# EAGLE board wio terminal (EAGLE 9.5.2), part 1 of 2
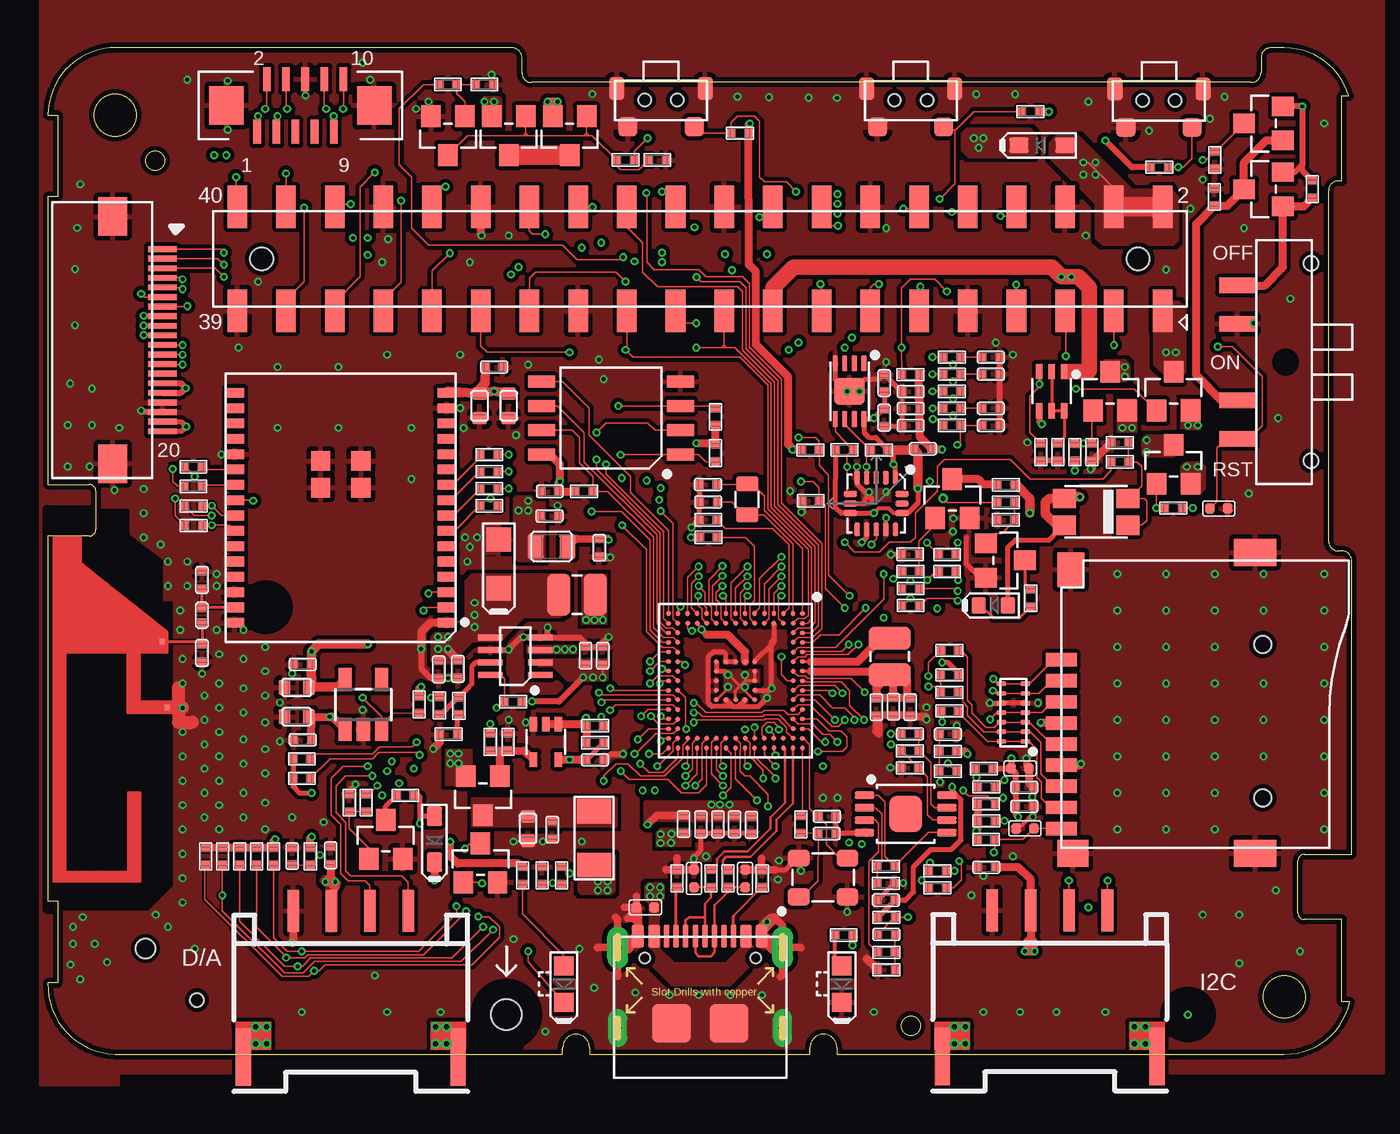
[diagram p8: board, top side]
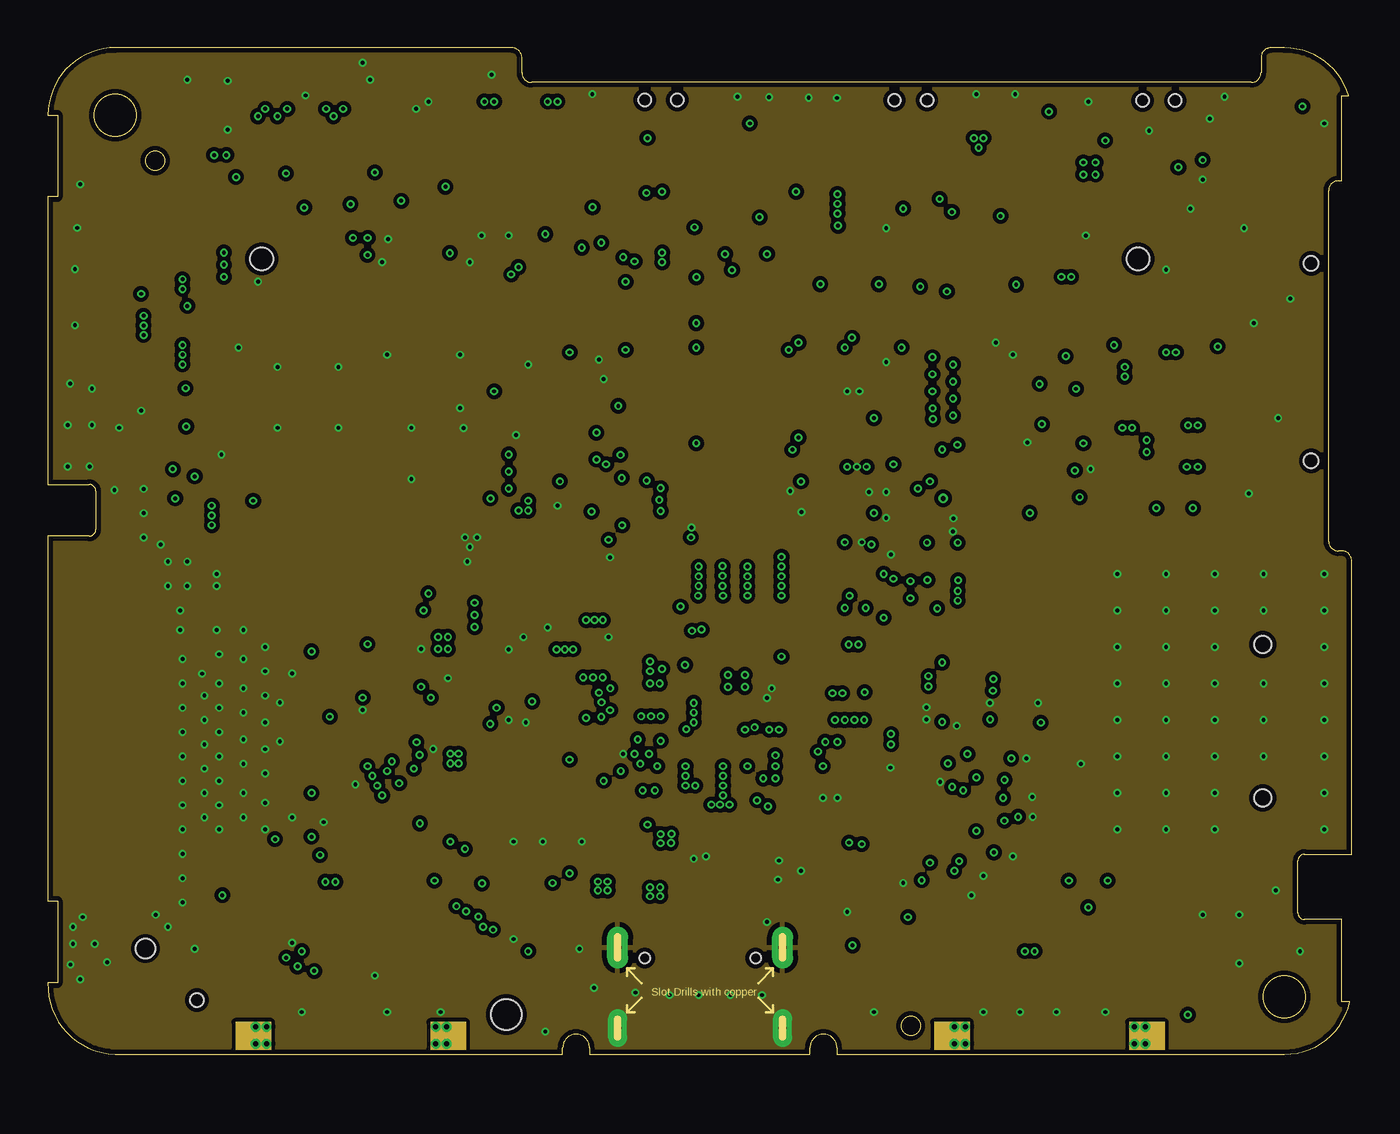
[diagram p9: board, inner layer Route2]
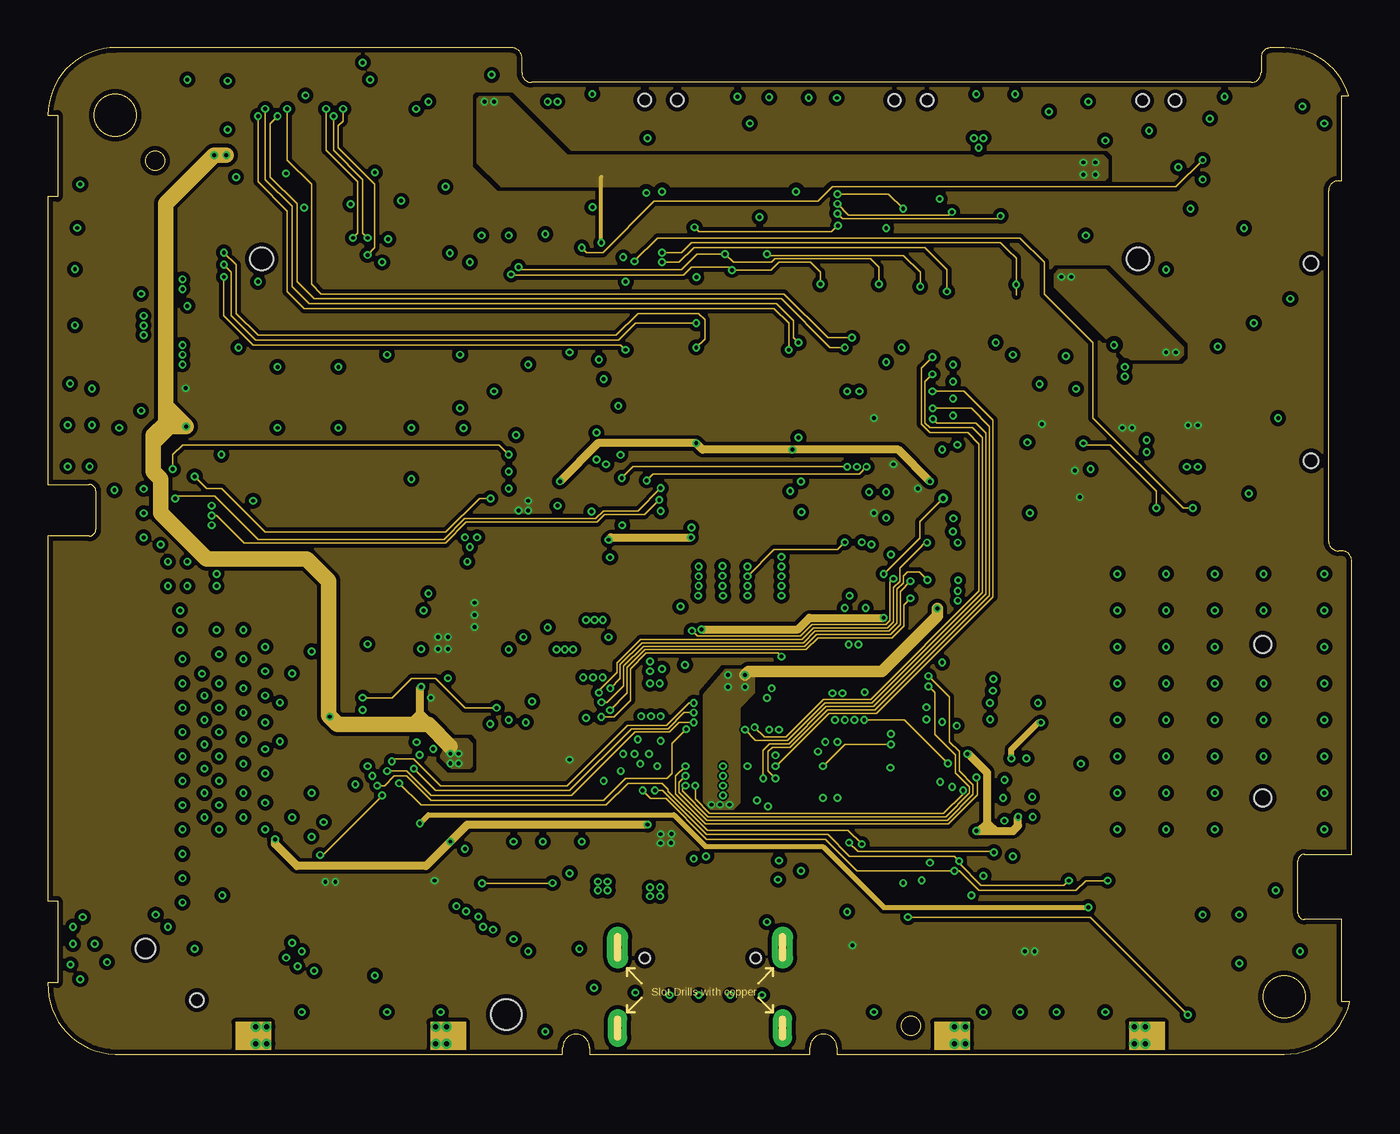
[diagram p10: board, inner layer Route15]
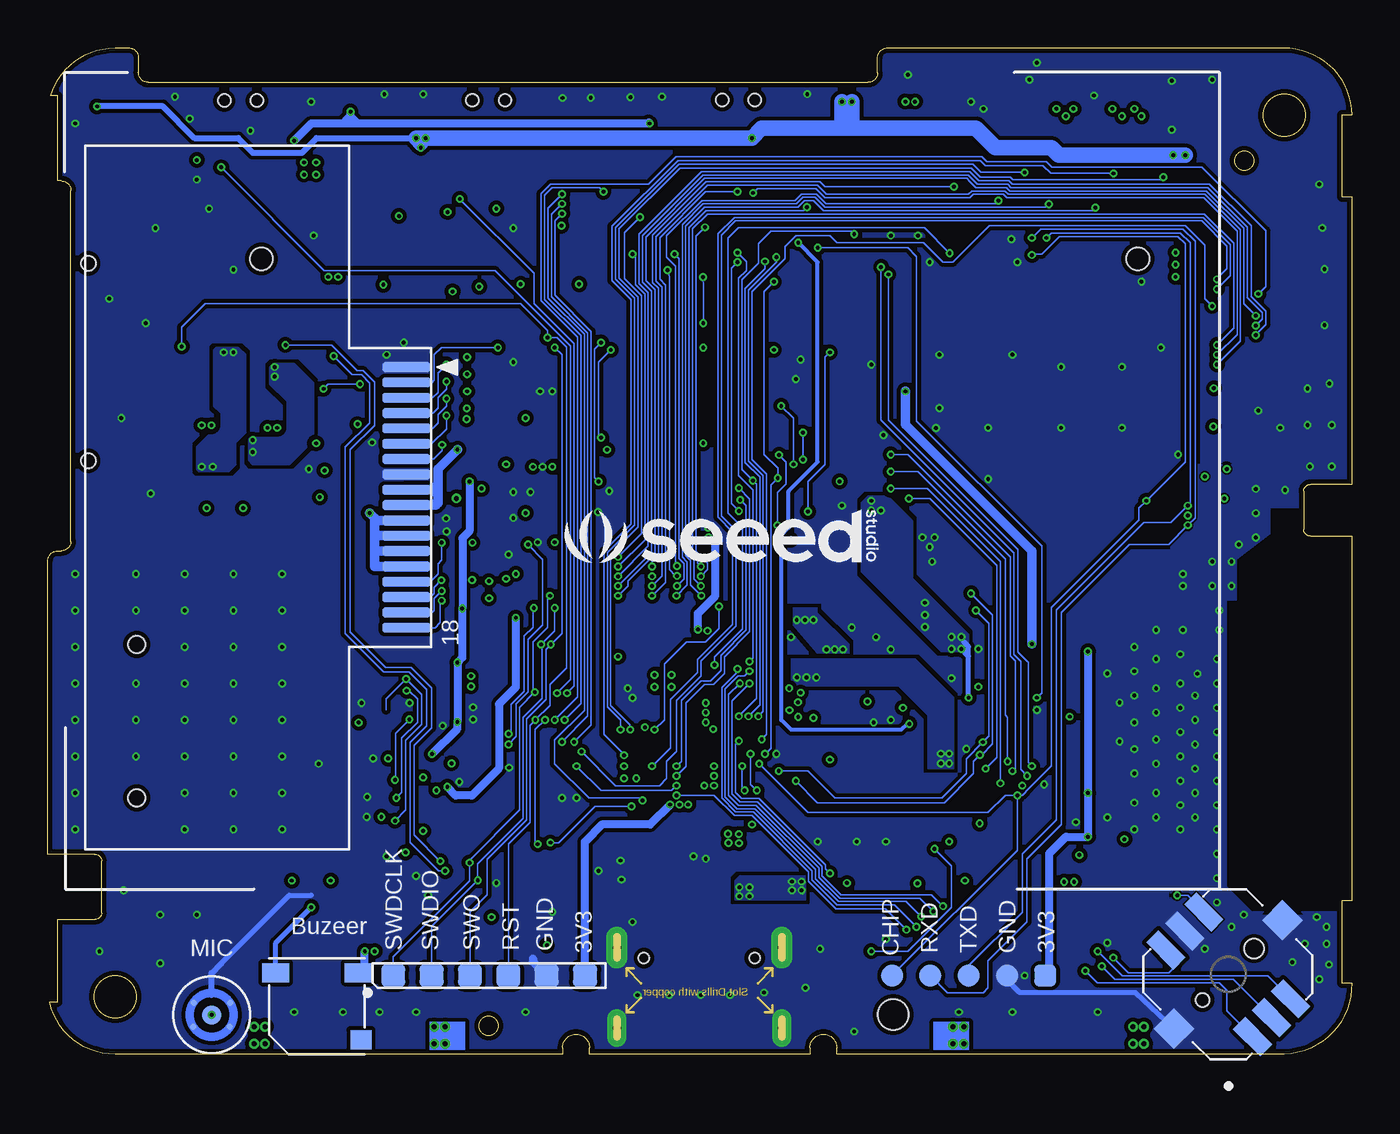
[diagram p11: board, bottom side, seen from below]

Size 68 x 52.5 mm. Coordinates in mm from the lower left corner, seen from the top.
Outline: 131 segments
Outline: circle at 64.5,3 radius 1.1
Outline: circle at 3.5,49 radius 1.1
Outline: circle at 5.6,46.62 radius 0.5
Outline: circle at 45,1.49 radius 0.5
Copper layers (1*2*15*16): Top 0.035mm / dielectric 0.2mm / Route2 0.0175mm / dielectric 0.3mm / Route15 0.0175mm / dielectric 0.2mm / Bottom 0.035mm
Design rules "SeeedStudio_4layer_DRU_no_angle_20140221 *": minimum track width 1mil, minimum drill 8mil, track to track 3.5mil, track to pad 3.5mil, pad to pad 3.5mil, via to via 3.5mil, smd to smd 0mil, copper to edge 10mil, drill to drill 8mil, minimum pad ring 4mil, minimum via ring 4mil, stop-mask expansion 4mil, vias tented up to drill 25mil, thermal gap 10mil
Holes 1.6 mm at 23.91,2.08
tRestrict: area 0,17.3 to 0.4,18.1; area 58.3,0.9 to 60.6,3.2; area 64.1,35.7 to 65,36.6; area 22.3,0.4 to 25.6,3.7

## Footprints (pad centres in the part's own frame; a part is rotated, then mirrored left to right if it is on the bottom)
ANT2P-AMEBA-D-MODULE = smd 0.26 x 0.26: 1 9.41,0.294; 2 12.86,0.544
BZ3-SMD-5.0X5.0X2.5MM = smd 1.4 x 1: + -2.15,-1.75; - 2.15,-1.75 | smd 1.1 x 1: NC -2.3,1.75
C0603 = smd 0.635 x 0.762: 1 -0.635,0; 2 0.635,0
C0402 = smd 0.445 x 0.508: 1 -0.445,0; 2 0.445,0
AVX-A = smd 1.27 x 1.27: + 1.27,0; - -1.27,0
ESD-0402 = smd 0.5 x 0.5: 1 -0.463,0; 2 0.463,0
SOD-323 = smd 1 x 0.8: + 1.2,0; - -1.2,0
LED-SIDE-VIEW-0603-RIGHT = smd 1 x 1: 1 0.95,0; 2 -0.95,0
LED-0603 = smd 0.762 x 0.889: + 0.762,0; - -0.762,0
UDFN14-0.5-3.5X1.35X0.5MM = smd 0.25 x 0.5: 1 -1.5,-0.625; 2 -1,-0.625; 3 -0.5,-0.625; 4 0,-0.625; 5 0.5,-0.625; 6 1,-0.625; 7 1.5,-0.625; 8 1.5,0.625; 9 1,0.625; 10 0.5,0.625; 11 0,0.625; 12 -0.5,0.625; 13 -1,0.625; 14 -1.5,0.625
F1206 = smd 1.27 x 1.778: 1 -1.397,0; 2 1.397,0
F0402 = smd 0.445 x 0.508: 1 -0.445,0; 2 0.445,0
MICRO-SD9+4P-SMD-16.1X14.5X1.85MM = smd 1.6 x 0.7: 1 0,2.25; 2 0,1.15; 3 0,0.05; 4 0,-1.05; 5 0,-2.15; 6 0,-3.25; 7 0,-4.35; 8 0,-5.45; 9 0,-6.55 | smd 1.6 x 1.4: G1 0.6,-7.85 | smd 2.2 x 1.4: G2 10.1,-7.85; G3 10.1,7.85 | smd 1.4 x 1.8: G4 0.5,6.95 | hole 0.9: 10.5,-4.95; 10.5,3.05
H5-SMD-2.0-TEST = smd 1.143 x 1.143: 1 0,4; 2 0,2; 3 0,0; 4 0,-2; 5 0,-4
FPC10-SMD-0.5-10.6X3.5X4.5MM = smd 0.4 x 1.25: 1 -2.25,-1.375; 2 -1.75,1.375; 3 -1.25,-1.375; 4 -0.75,1.375; 5 -0.25,-1.375; 6 0.25,1.375; 7 0.75,-1.375; 8 1.25,1.375; 9 1.75,-1.375; 10 2.25,1.375 | smd 1.8 x 2: P1 -3.85,0; P2 3.85,0
HW4-SMD-2.0-90D = smd 0.6 x 2.2: 1 -3,-0.225; 2 -1,-0.225; 3 1,-0.225; 4 3,-0.225 | smd 0.8 x 3: SS1 -5.6,7.4; SS2 5.6,7.4
FPC20-SMD-0.5-90D = smd 0.3 x 1.5: 1 -4.75,3.15; 2 -4.25,3.15; 3 -3.75,3.15; 4 -3.25,3.15; 5 -2.75,3.15; 6 -2.25,3.15; 7 -1.75,3.15; 8 -1.25,3.15; 9 -0.75,3.15; 10 -0.25,3.15; 11 0.25,3.15; 12 0.75,3.15; 13 1.25,3.15; 14 1.75,3.15; 15 2.25,3.15; 16 2.75,3.15; 17 3.25,3.15; 18 3.75,3.15; 19 4.25,3.15; 20 4.75,3.15 | smd 2 x 1.5: P1 -6.45,0.55; P2 6.45,0.55
H6-SMD-2.0_TEST = smd 1.27 x 1.27: 1 0,5; 2 0,3; 3 0,1; 4 0,-1; 5 0,-3; 6 0,-5
SW2+2P-3.45-4.8X2.5X1.8MM = smd 1 x 1: 1 -1.725,-1.4; 2 1.725,-1.4 | smd 0.8 x 1.2: 3 -2.3,0.6; 4 2.3,0.6 | hole 0.65: -0.85,0; 0.85,0
L0805 = smd 0.826 x 1.27: 1 -0.826,0; 2 0.826,0
L0402 = smd 0.508 x 0.508: 1 -0.406,0; 2 0.406,0
L2520 = smd 1.2 x 2.2: 1 -0.95,0; 2 0.95,0
MIC2-SMD-4X4MM = smd 1 x 1: 1 0,0 | smd 0.35 x 0.35: 2 -0.934,0.635; 3 0.953,0.617; 4 0.934,-0.635; 5 -0.953,-0.617
SOT-23 = smd 1.143 x 1.016: 1 1.016,-0.889; 2 1.016,0.889; 3 -1.016,0
SOT-363 = smd 0.35 x 0.8: 1 -0.65,-1.025; 2 0,-1.025; 3 0.65,-1.025; 4 0.65,1.025; 5 0,1.025; 6 -0.65,1.025
R0402 = smd 0.445 x 0.508: 1 -0.445,0; 2 0.445,0
SWITCH-2X3P = smd 0.9 x 2: 1 -1.4,-3.2; 2 0,-3.2; 3 1.4,-3.2; 4 -1.4,3.2; 5 0,3.2; 6 1.4,3.2 | smd 1.5 x 1.5: 7 4,0; 8 -4,0 | hole 0.7: -1.9,0 | hole 1: 1.9,0
SW4-SMD-11.2X3.6MM = smd 0.8 x 1.9: 1 -4,-0.35; 2 -2,-0.35; 3 2,-0.35; 4 4,-0.35 | hole 0.75: -5.15,-4.2; 5.15,-4.2
TFBGA120-0.5-8X8MM = smd 0.229 x 0.279: A1 -3.5,3.5; A2 -3,3.5; A3 -2.5,3.5; A4 -2,3.5; A5 -1.5,3.5; A6 -1,3.5; A7 -0.5,3.5; A8 0,3.5; A9 0.5,3.5; A10 1,3.5; A11 1.5,3.5; A12 2,3.5; A13 2.5,3.5; A14 3,3.5; B11 1.5,3; B12 2,3; R2 -3,-3.5; R3 -2.5,-3.5; R4 -2,-3.5; R5 -1.5,-3.5; R6 -1,-3.5; R7 -0.5,-3.5; R8 0,-3.5; R9 0.5,-3.5; R10 1,-3.5; R11 1.5,-3.5; R12 2,-3.5; R13 2.5,-3.5; R14 3,-3.5 | smd 0.279 x 0.229: A15 3.5,3.5; B1 -3.5,3; B15 3.5,3; C1 -3.5,2.5; C15 3.5,2.5; D1 -3.5,2; D15 3.5,2; E1 -3.5,1.5; E15 3.5,1.5; F1 -3.5,1; F15 3.5,1; G1 -3.5,0.5; G15 3.5,0.5; H1 -3.5,0; H15 3.5,0; J1 -3.5,-0.5; J15 3.5,-0.5; K1 -3.5,-1; K15 3.5,-1; L1 -3.5,-1.5; L15 3.5,-1.5; M1 -3.5,-2; M15 3.5,-2; N1 -3.5,-2.5; N15 3.5,-2.5; P1 -3.5,-3; P15 3.5,-3; R1 -3.5,-3.5; R15 3.5,-3.5 | smd 0.25 x 0.25: B2 -3,3; B3 -2.5,3; B4 -2,3; B5 -1.5,3; B6 -1,3; B7 -0.5,3; B8 0,3; B9 0.5,3; B10 1,3; B13 2.5,3; B14 3,3; C2 -3,2.5; C14 3,2.5; D2 -3,2; D14 3,2; E2 -3,1.5; E14 3,1.5; F2 -3,1; F6 -1,1; F7 -0.5,1; F8 0,1; F9 0.5,1; F10 1,1; F14 3,1; G2 -3,0.5; G6 -1,0.5; G10 1,0.5; G14 3,0.5; H2 -3,0; H6 -1,0; H10 1,0; H14 3,0; J2 -3,-0.5; J6 -1,-0.5; J10 1,-0.5; J14 3,-0.5; K2 -3,-1; K6 -1,-1; K7 -0.5,-1; K8 0,-1; K9 0.5,-1; K10 1,-1; K14 3,-1; L2 -3,-1.5; L14 3,-1.5; M2 -3,-2; M14 3,-2; N2 -3,-2.5; N14 3,-2.5; P2 -3,-3; P3 -2.5,-3; P4 -2,-3; P5 -1.5,-3; P6 -1,-3; P7 -0.5,-3; P8 0,-3; P9 0.5,-3; P10 1,-3; P11 1.5,-3; P12 2,-3; P13 2.5,-3; P14 3,-3
MSOP8-0.65-3X3MM = smd 0.4 x 1: 1 -0.975,-2.15; 2 -0.325,-2.15; 3 0.325,-2.15; 4 0.975,-2.15; 5 0.975,2.15; 6 0.325,2.15; 7 -0.325,2.15; 8 -0.975,2.15 | smd 1.89 x 1.7: 9 0,0
H2X20-SMD-2.54-50.8X5MM-LONG = smd 1.02 x 2.2 bottom: 1 -24.13,-2.715; 2 -24.13,2.715; 3 -21.59,-2.715; 4 -21.59,2.715; 5 -19.05,-2.715; 6 -19.05,2.715; 7 -16.51,-2.715; 8 -16.51,2.715; 9 -13.97,-2.715; 10 -13.97,2.715; 11 -11.43,-2.715; 12 -11.43,2.715; 13 -8.89,-2.715; 14 -8.89,2.715; 15 -6.35,-2.715; 16 -6.35,2.715; 17 -3.81,-2.715; 18 -3.81,2.715; 19 -1.27,-2.715; 20 -1.27,2.715; 21 1.27,-2.715; 22 1.27,2.715; 23 3.81,-2.715; 24 3.81,2.715; 25 6.35,-2.715; 26 6.35,2.715; 27 8.89,-2.715; 28 8.89,2.715; 29 11.43,-2.715; 30 11.43,2.715; 31 13.97,-2.715; 32 13.97,2.715; 33 16.51,-2.715; 34 16.51,2.715; 35 19.05,-2.715; 36 19.05,2.715; 37 21.59,-2.715; 38 21.59,2.715; 39 24.13,-2.715; 40 24.13,2.715 | hole 1.2: -22.86,0; 22.86,0
LCM18-0.8-60.26X42.72X2.2MM = smd 0.5 x 2.5: 1 -6.8,-0.004; 2 -6,-0.004; 3 -5.2,-0.004; 4 -4.4,-0.004; 5 -3.6,-0.004; 6 -2.8,-0.004; 7 -2,-0.004; 8 -1.2,-0.004; 9 -0.4,-0.004; 10 0.4,-0.004; 11 1.2,-0.004; 12 2,-0.004; 13 2.8,-0.004; 14 3.6,-0.004; 15 4.4,-0.004; 16 5.2,-0.004; 17 6,-0.004; 18 6.8,-0.004
LGA16-0.5-3X3MM = smd 0.7 x 0.3: 1 -1.35,0.873; 2 -1.35,0.373; 3 -1.35,-0.127; 4 -1.35,-0.627; 5 -1.35,-1.127; 9 1.35,-1.127; 10 1.35,-0.627; 11 1.35,-0.127; 12 1.35,0.373; 13 1.35,0.873 | smd 0.3 x 0.7: 6 -0.5,-1.477; 7 0,-1.477; 8 0.5,-1.477; 14 0.5,1.223; 15 0,1.223; 16 -0.5,1.223
SNR4-SMD-3.2X2.7MM = smd 1.2 x 1: 1-1 1.65,0.7; 1-2 1.65,-0.7; 2-1 -1.65,0.7; 2-2 -1.65,-0.7
SC-70-5 = smd 0.4 x 0.75: 1 -0.65,-0.925; 2 0,-0.925; 3 0.65,-0.925; 4 0.65,0.925; 5 -0.65,0.925
MODULE-32P-0.8-13X12MM-MOTHER = smd 0.95 x 0.5: 1 -5.525,6; 2 -5.525,5.2; 3 -5.525,4.4; 4 -5.525,3.6; 5 -5.525,2.8; 6 -5.525,2; 7 -5.525,1.2; 8 -5.525,0.4; 9 -5.525,-0.4; 10 -5.525,-1.2; 11 -5.525,-2; 12 -5.525,-2.8; 13 -5.525,-3.6; 14 -5.525,-4.4; 15 -5.525,-5.2; 16 -5.525,-6; 17 5.525,-6; 18 5.525,-5.2; 19 5.525,-4.4; 20 5.525,-3.6; 21 5.525,-2.8; 22 5.525,-2; 23 5.525,-1.2; 24 5.525,-0.4; 25 5.525,0.4; 26 5.525,1.2; 27 5.525,2; 28 5.525,2.8; 29 5.525,3.6; 30 5.525,4.4; 31 5.525,5.2; 32 5.525,6 | smd 1 x 1: 51 1.05,-1.05; 54 1.05,-2.45; 60 -1.05,-1.05; 61 -1.05,-2.45
UDFN8-0.5-2X3X0.5MM = smd 0.85 x 0.28: 1 -1.45,0.75; 2 -1.45,0.25; 3 -1.45,-0.25; 4 -1.45,-0.75; 5 1.45,-0.75; 6 1.45,-0.25; 7 1.45,0.25; 8 1.45,0.75 | smd 1.4 x 1.6: 9 0,0
TSOT23-8 = smd 0.3 x 1.27: 1 -0.975,-1.3; 2 -0.325,-1.3; 3 0.325,-1.3; 4 0.975,-1.3; 5 0.975,1.3; 6 0.325,1.3; 7 -0.325,1.3; 8 -0.975,1.3
SOT-23-5 = smd 0.69 x 1.2: 1 -0.95,-1.3; 2 0,-1.3; 3 0.95,-1.3; 4 0.95,1.3; 5 -0.95,1.3
SOIC8-1.27-5.3X5.3MM = smd 0.62 x 1.4: 1 -1.905,-3.623; 2 -0.635,-3.623; 3 0.635,-3.623; 4 1.905,-3.623; 5 1.905,3.623; 6 0.635,3.623; 7 -0.635,3.623; 8 -1.905,3.623
USB2.0-TYPE-C = smd 1.2 x 0.6: A1_B12 0.05,3.25; A4_B9 0.05,2.4; B1_A12 0.05,-3.2; B4_A9 0.05,-2.4 | smd 1.2 x 0.3: A5 0.05,1.25; A6 0.05,0.25; A7 0.05,-0.25; A8 0.05,-1.25; B5 0.05,-1.75; B6 0.05,-0.75; B7 0.05,0.75; B8 0.05,1.75 | drill 0.4 pad 1 long: S1 -4.75,4.3; S2 -4.75,-4.3 | drill 0.4 pad 1.1 long: S3 -0.55,4.3; S4 -0.55,-4.3 | smd 2 x 2: S5 -4.5,1.5; S6 -4.5,-1.5 | hole 0.55: -1.1,-2.89; -1.1,2.89
X2-SMD-L2.0X1.2X0.55MM = smd 0.762 x 1.143: 1 -0.813,0; 2 0.813,0
X4-SMD-3.2X2.5X0.7MM = smd 1.143 x 0.889: 1 -1.27,-1.016; 2 1.27,-1.016; 3 1.27,1.016; 4 -1.27,1.016

## Placement (x,y rotation side)
ANT2  2.4G+5G  [ANT2P-AMEBA-D-MODULE]  6.51,8.68 90 top
BUZ1  LET5020CS-03L-4.0-12-R  [BZ3-SMD-5.0X5.0X2.5MM]  53.97,2.51 180 bottom
C1  22uF  [C0603]  24.04,33.83 90 top
C2  10uF  [C0603]  22.51,33.83 90 top
C3  10uF  [C0603]  12.98,17.61 0 top
C4  10uF/10V  [C0603]  25.04,11.78 90 top
C5  100nF  [C0402]  26.31,11.72 90 top
C6  22uF  [C0603]  12.98,19.14 0 top
C7  100nF  [C0402]  13.29,20.34 180 top
C8  100nF  [C0402]  13.29,16.41 180 top
C9  1uF  [C0402]  12.74,10.34 90 top
C10  100nF  [C0402]  23.28,35.86 0 top
C11  100nF  [C0402]  43.62,35.02 270 top
C12  10pF  [C0402]  49.18,36.37 0 top
C13  10pF  [C0402]  49.18,35.48 0 top
C14  100nF  [C0402]  43.62,33.21 90 top
C15  100nF  [C0402]  50.93,13.93 0 top
C16  1uF  [C0402]  50.93,12.94 0 top
C27  DNP  [C0402]  8.04,24.75 270 top
C28  DNP  [C0402]  8.04,20.94 90 top
C29  100nF  [C0402]  45,32.79 0 top
C30  100nF  [C0402]  45,33.68 0 top
C31  100nF  [C0402]  45,34.57 0 top
C32  100nF  [C0402]  28.54,15.36 0 top
C33  100nF  [C0402]  43.71,8.04 180 top
C34  1uF  [C0402]  43.73,6.25 0 top
C35  100nF  [C0402]  46.95,16.7 0 top
C36  100nF  [C0402]  44.98,18.11 270 top
C37  1uF  [C0402]  43.21,18.11 270 top
C38  10uF  [C0402]  44.1,18.14 270 top
C39  100nF  [C0402]  34.06,11.99 270 top
C40  10uF  [C0402]  35.81,11.99 270 top
C41  1uF  [C0402]  36.7,11.97 270 top
C42  10pF  [C0402]  49.18,32.81 0 top
C43  10pF  [C0402]  49.18,33.7 0 top
C48  100nF  [C0402]  26.18,29.37 180 top
C49  22pF  [C0402]  34.44,29.73 0 top
C50  22pF  [C0402]  34.44,28.81 0 top
C51  12pF  [C0402]  40.64,12.41 0 top
C52  12pF  [C0402]  40.62,11.51 0 top
C53  1uF  [C0402]  48.95,9.76 180 top
C54  1uF  [C0402]  14.75,10.38 90 top
C55  1uF  [C0402]  44.97,16.72 180 top
C60  10uF  [C0402]  28.76,26.42 270 top
C61  10uF  [C0402]  26.16,28.09 0 top
C62  10uF  [C0402]  34.94,12 270 top
C63  22uF/10V  [AVX-A]  23.52,25.59 270 top
C64  10uF  [C0402]  21.38,20.11 90 top
C65  10uF  [C0402]  20.39,20.08 90 top
C66  10uF  [C0402]  28.94,20.79 270 top
C67  10uF  [C0402]  28.05,20.79 270 top
D1  ESD9B3.3ST5G  [ESD-0402]  50.71,14.92 180 top
D2  CESDP0402UC5VB  [ESD-0402]  31.16,7.67 180 top
D3  CESDP0402UC5VB  [ESD-0402]  33.7,9.17 90 top
D4  CESDP0402UC5VB  [ESD-0402]  36.37,9.17 90 top
D5  B5819WS  [SOD-323]  20.16,11.22 90 top
D6  ESD9B3.3ST5G  [ESD-0402]  61.07,28.48 180 top
D7  Blue 90D  [LED-SIDE-VIEW-0603-RIGHT]  26.91,3.67 90 top
D8  ESD9B3.3ST5G  [ESD-0402]  50.96,11.78 0 top
D9  B5819WS  [SOD-323]  51.85,47.42 0 top
D10  IR  [LED-0603]  49.31,23.41 0 top
D15  SP3012-06UTG  [UDFN14-0.5-3.5X1.35X0.5MM]  50.36,17.83 90 top
F1  1206L300SLTHYR  [F1206]  28.48,11.28 90 top
FB2  120R/2A  [F0402]  45.64,31.59 0 top
FB3  120R/2A  [F0402]  33.15,12.01 90 top
J1  ST-TF-003J  [MICRO-SD9+4P-SMD-16.1X14.5X1.85MM]  52.87,18.33 0 top
J2  DL  [H5-SMD-2.0-TEST]  19.97,4.11 270 bottom
J3  [FPC10-SMD-0.5-10.6X3.5X4.5MM]  13.17,49.5 0 top
J4  SMD_GROVE  [HW4-SMD-2.0-90D]  52.26,7.28 180 top
J5  SMD_GROVE  [HW4-SMD-2.0-90D]  15.79,7.26 180 top
J6  XW05200-20  [FPC20-SMD-0.5-90D]  2.83,37.26 270 top
J7  SMD_Header  [H6-SMD-2.0_TEST]  44.99,4.1 90 bottom
K1  [SW2+2P-3.45-4.8X2.5X1.8MM]  31.98,49.79 0 top
K2  [SW2+2P-3.45-4.8X2.5X1.8MM]  45,49.77 0 top
K3  [SW2+2P-3.45-4.8X2.5X1.8MM]  57.95,49.75 0 top
L2  2.2uH  [L0805]  26.27,26.49 180 top
L3  0.5pF  [L0402]  8.04,22.9 90 top
L5  SPH252012H1R2MT  [L2520]  27.61,23.97 180 top
L6  CBC3225T100MR  [L2520]  43.91,20.76 270 top
LED1  Green 90D  [LED-SIDE-VIEW-0603-RIGHT]  41.41,3.67 90 top
MIC1  B4013AM422-042  [MIC2-SMD-4X4MM]  59.46,2.06 180 bottom
Q1  2N7002,215  [SOT-23]  47.18,28.99 270 top
Q2  CJ3407  [SOT-23]  22.69,13.5 90 top
Q3  2N7002,215  [SOT-23]  22.57,10 270 top
Q4  2N7002,215  [SOT-23]  17.62,11.22 270 top
Q7  CJ3407  [SOT-23]  63.41,48.56 0 top
Q8  CJ3407  [SOT-23]  63.41,45.13 0 top
Q9  CJ3407  [SOT-23]  27.21,47.92 90 top
Q10  CJ3407  [SOT-23]  58.71,34.59 270 top
Q11  BC856S  [SOT-363]  52.36,34.59 180 top
Q12  CJ3407  [SOT-23]  55.41,34.59 270 top
Q13  2N7002,215  [SOT-23]  49.95,25.76 180 top
Q14  CJ3407  [SOT-23]  24.04,47.92 90 top
Q15  CJ3407  [SOT-23]  58.71,30.78 270 top
Q16  2N7002,215  [SOT-23]  20.86,47.92 90 top
R1  5.1K  [R0402]  32.81,9.17 270 top
R2  5.1K  [R0402]  37.26,9.17 270 top
R3  4.7K  [R0402]  51.25,49.18 0 top
R4  4.7K  [R0402]  57.97,46.28 180 top
R5  0R  [R0402]  16.6,13.13 270 top
R6  33R  [R0402]  18.64,13.51 180 top
R7  100K  [R0402]  15.72,13.13 270 top
R8  0R  [R0402]  39.28,11.99 270 top
R9  10K  [R0402]  46.94,15.81 0 top
R10  DNP  [R0402]  7.59,30.65 0 top
R11  4.7k  [R0402]  13.69,10.33 90 top
R12  0R  [R0402]  34.45,26.97 0 top
R13  4.7K  [R0402]  43.35,31.52 180 top
R14  4.7K  [R0402]  41.55,31.53 0 top
R16  100K  [R0402]  44.98,26.08 180 top
R17  0R  [R0402]  44.99,25.19 180 top
R18  100K  [R0402]  28.54,16.25 180 top
R19  100K  [R0402]  24,16.3 90 top
R20  4.7K  [R0402]  23.08,16.3 270 top
R21  0R  [R0402]  28.54,17.14 0 top
R22  10K  [R0402]  43.74,7.15 0 top
R23  100K  [R0402]  43.73,4.41 180 top
R24  100K  [R0402]  43.73,5.32 0 top
R25  1K  [R0402]  43.71,8.92 180 top
R26  10K  [R0402]  43.72,9.81 0 top
R27  10K  [R0402]  44.96,15.83 0 top
R28  1K  [R0402]  44.96,14.94 0 top
R29  100k  [R0402]  65.95,45.13 90 top
R30  330R  [R0402]  46.95,14.77 0 top
R31  1K  [R0402]  41.51,6.22 180 top
R32  DNP  [R0402]  34.82,31.37 90 top
R33  DNP  [R0402]  46.39,9.57 180 top
R34  DNP  [R0402]  46.39,8.68 180 top
R35  33R  [R0402]  47.15,36.37 180 top
R36  100K  [R0402]  48.94,11.21 180 top
R37  100K  [R0402]  8.23,10.33 90 top
R38  4.7K  [R0402]  39.77,31.53 0 top
R39  0R  [R0402]  46.91,26.08 0 top
R40  0R  [R0402]  46.91,25.19 0 top
R41  0R  [R0402]  45,24.3 0 top
R42  0R  [R0402]  45,23.41 0 top
R43  33R  [R0402]  47.02,18.88 180 top
R44  33R  [R0402]  47.03,21.07 180 top
R45  33R  [R0402]  48.95,13.95 180 top
R46  0R  [R0402]  49.96,29.71 180 top
R47  1k  [R0402]  49.97,28.8 180 top
R48  4.7K  [R0402]  44.99,35.46 0 top
R49  4.7K  [R0402]  36.1,48.05 0 top
R50  DNP  [R0402]  34.44,27.89 180 top
R51  1k  [R0402]  24.77,9.33 270 top
R52  100k  [R0402]  25.78,9.33 270 top
R53  0R  [R0402]  26.8,9.33 270 top
R54  4.7K  [R0402]  39.79,28.87 180 top
R55  22R  [R0402]  34.59,9.17 90 top
R56  22R  [R0402]  35.48,9.17 270 top
R57  33R  [R0402]  47.15,35.48 180 top
R58  DNP  [R0402]  34.82,33.26 270 top
R59  DNP  [R0402]  27.96,29.37 180 top
R60  DNP  [R0402]  47.03,17.91 180 top
R61  4.7K  [R0402]  47.03,19.79 0 top
R62  4.7K  [R0402]  48.82,14.9 0 top
R63  4.7K  [R0402]  48.94,13.06 180 top
R64  DNP  [R0402]  48.95,12.17 180 top
R65  DNP  [R0402]  7.59,29.64 0 top
R66  0R  [R0402]  23.02,28.62 0 top
R67  0R  [R0402]  23.02,31.29 0 top
R68  0R  [R0402]  7.6,28.6 0 top
R69  0R  [R0402]  7.6,27.59 0 top
R70  150K  [R0402]  20.42,18.2 90 top
R71  33K  [R0402]  21.43,18.18 90 top
R72  0R  [R0402]  20.9,16.7 0 top
R73  DNP  [R0402]  24.27,18.4 0 top
R74  33R  [R0402]  47.15,34.59 180 top
R75  33R  [R0402]  47.15,33.7 180 top
R76  33R  [R0402]  47.15,32.81 180 top
R77  10K  [R0402]  55.92,31.92 0 top
R78  100k  [R0402]  60.87,46.65 90 top
R79  0R  [R0402]  55.92,30.91 180 top
R80  100k  [R0402]  49.97,27.88 180 top
R81  0R  [R0402]  23.02,30.4 0 top
R82  0R  [R0402]  23.02,29.51 0 top
R83  0R  [R0402]  51.26,23.79 90 top
R84  100K  [R0402]  10,10.33 90 top
R85  100K  [R0402]  11.78,10.33 90 top
R86  100K  [R0402]  10.89,10.33 90 top
R87  100K  [R0402]  9.12,10.33 90 top
R88  1K  [R0402]  20.86,50.59 0 top
R90  DNP  [R0402]  19.36,18.25 270 top
R91  100K  [R0402]  60.84,44.72 90 top
R93  DNP  [R0402]  31.79,46.65 180 top
R94  10K  [R0402]  30.13,46.65 0 top
R95  100K  [R0402]  54.45,31.41 90 top
R96  10K  [R0402]  53.57,31.41 270 top
R97  10K  [R0402]  51.79,31.41 90 top
R98  10K  [R0402]  52.68,31.41 90 top
R99  1K  [R0402]  58.71,28.49 0 top
R100  100K  [R0402]  22.77,50.59 180 top
R102  DNP  [R0402]  13.24,14.4 180 top
R103  DNP  [R0402]  13.24,15.41 180 top
SW1  DHT-1500  [SWITCH-2X3P]  6.43,4.17 45 bottom
SW3  MK-13E03N-G  [SW4-SMD-11.2X3.6MM]  61.69,36.11 90 top
U1  ATSAMD51P19A  [TFBGA120-0.5-8X8MM]  35.87,19.49 270 top
U2  LMV358IDGKR  [MSOP8-0.65-3X3MM]  44.74,12.54 270 top
U3  RPI  [H2X20-SMD-2.54-50.8X5MM-LONG]  34.01,41.5 0 bottom
U4  LCD  [LCM18-0.8-60.26X42.72X2.2MM]  49.3,29.05 270 bottom
U5  LIS3DHTR  [LGA16-0.5-3X3MM]  43.33,28.73 270 top
U8  SENSOR-PD15-22C/TR8  [SNR4-SMD-3.2X2.7MM]  54.68,28.3 180 top
U9  SN74LVC1G125DCKR  [SC-70-5]  25.97,16.3 180 top
U10  RTL8720D  [MODULE-32P-0.8-13X12MM-MOTHER]  15.28,28.51 180 top
U11  ATECC608  [UDFN8-0.5-2X3X0.5MM]  41.82,34.59 270 top
U12  MP2161GJ  [TSOT23-8]  24.38,20.76 90 top
U13  AP2112K-3.3TRG1  [SOT-23-5]  16.46,18.25 0 top
U14  W25Q32JVZPIM  [SOIC8-1.27-5.3X5.3MM]  29.37,33.19 90 top
U$2  LOGO-SEEED-VECTOR  [SEEED-SILK-VECTOR]  41.08,25.64 0 bottom
USB1  USB_TYPE C  [USB2.0-TYPE-C]  34.02,6.12 90 top
X2  32.768KHz FC-12M  [X2-SMD-L2.0X1.2X0.55MM]  36.47,28.95 90 top
X4  32MHz / 306010026  [X4-SMD-3.2X2.5X0.7MM]  40.43,9.23 0 top

## Tracks (layer width: path | path; a pad name or v marks a point on that pad's centre or on a via)
3V3_OUTPUT_CTR  (via drill 0.2 pad 0.41)
  Top 0.089: 32.87,17.51 U1.P12 32.62,17.24 31.85,17.24 v31.46,17.63 | R99.2 v59.73,28.49
  Route15 0.089: v59.73,28.49 59.22,28.49 54.52,33.19 54.52,37.13 51.98,39.67 51.98,41.32 50.71,42.59 31.79,42.59 30.6,41.41 v30.6,41.36
  Bottom 0.089: v31.46,17.63 30.87,18.22 30.87,30.12 31.63,30.88 31.63,39.95 30.6,40.98 v30.6,41.36
5V_OUTPUT_CTR  (via drill 0.2 pad 0.41)
  Top 0.089: U1.R11 31.3,17.99 v30.95,17.63 | v30,41.57 v30.01,41.58 29.87,41.45 27.59,41.45 26.83,42.21 19.85,42.21 18.96,43.1 18.96,45.76 18.32,46.4 18.32,49.32 19.59,50.59 R88.1
  Bottom 0.089: v30.95,17.63 30.69,17.89 30.69,30.19 31.46,30.95 31.46,39.88 30.01,41.33 v30.01,41.58
A0/D0  (via drill 0.2 pad 0.41)
  Top 0.089: 35.38,22.49 U1.J2 35.35,22.49 35.11,22.73 35.11,23.46 34.86,23.72 34.86,24.1 v35.19,24.43 | J5.1 18.79,8.97 18.45,9.32 15.78,9.32 15.53,9.57 15.53,12.11 15.02,12.62 15.02,14.01 15.53,14.52 v16.93,14.52 | U3.13 42.9,39.99 43.09,40.18 v43.34,40.18
  Route15 0.089: v43.34,40.18 43.34,41.07 42.91,41.5 37.93,41.5 37.75,41.32 35.75,41.32 v35.32,41.74 33.86,41.74 33.06,40.94 24.67,40.94 v24.55,41.07
  Bottom 0.089: v35.19,24.43 34.83,24.78 34.83,25.61 35.09,25.86 35.09,41.51 v35.32,41.74 | v24.55,41.07 24.55,33.08 17.62,26.16 17.62,20.86 17.26,20.49 17.26,14.85 v16.93,14.52
A1/D1  (via drill 0.2 pad 0.41)
  Top 0.089: U1.K1 34.87,23.38 34.67,23.58 34.67,24.44 v35.19,24.96 | 40.49,38.41 U3.15 40.36,40.11 v40.29,40.18 | J5.2 16.79,8.81 16.55,9.06 15.66,9.06 15.28,9.44 15.28,11.98 14.77,12.49 14.77,14.4 15.4,15.03 v16.67,15.03
  Route15 0.089: v40.29,40.18 40.29,40.81 39.79,41.32 38.13,41.32 37.73,40.91 v35.68,40.91 35.53,41.07 33.56,41.07 33.16,40.66 24.19,40.66 v24.17,40.68
  Bottom 0.089: v35.19,24.96 35.25,24.96 35.59,25.3 35.59,40.56 v35.68,40.91 | v24.17,40.68 24.17,33.08 17.42,26.33 17.42,21 16.85,20.44 16.85,15.23 16.67,15.05 v16.67,15.03
A2/D2  (via drill 0.2 pad 0.41)
  Top 0.089: U1.M1 33.56,23.29 33.56,24.56 v33.94,24.94 | 40.49,43.34 40.49,43.58 U3.16 40.36,43.22 | 40.36,43.22 40.36,43.16 | v41.21,43.22 40.36,43.22
  Route15 0.089: v33.73,43.14 33.95,42.92 40.88,42.92 41.18,43.22 v41.21,43.22
  Bottom 0.089: v33.94,24.94 33.59,25.29 33.59,25.62 34.2,26.23 34.2,42.67 v33.73,43.14
A3/D3  (via drill 0.2 pad 0.41)
  Top 0.089: U1.F1 36.87,23.03 37.12,23.29 37.12,24.81 v38.26,25.95 | U3.18 37.16,43.71 v37.12,43.67
  Bottom 0.089: v38.26,25.95 37.04,27.17 37.04,39.58 37.91,40.45 37.91,42.88 v37.12,43.67
A4/D4  (via drill 0.2 pad 0.41)
  Top 0.089: U1.G1 36.37,23.8 v36.48,23.92 | U3.22 32.74,44.69 32.42,45 v32.04,45
  Bottom 0.089: v36.48,23.92 35.78,24.63 35.78,40.13 36.08,40.43 36.08,42.61 33.69,45 v32.04,45
A5/D5  (via drill 0.2 pad 0.41)
  Top 0.089: 35.82,22.49 U1.H2 35.62,22.73 35.62,24.58 v36.48,25.44 | U3.32 20.04,44.81 20.55,45.32 20.67,45.32 v20.74,45.26
  Bottom 0.089: v36.48,25.44 36.48,25.7 36.15,26.03 36.15,39.96 36.46,40.26 36.46,42.74 33.68,45.52 27.72,45.52 27.46,45.26 v20.74,45.26
A6/D6  (via drill 0.2 pad 0.41)
  Top 0.089: U1.K2 34.84,22.49 34.61,22.72 34.61,23.33 34.48,23.47 34.48,24.76 v35.19,25.47 | U3.33 17.5,39.35 18.43,40.28 v18.43,44.53
  Bottom 0.089: v35.19,25.47 35.2,25.47 35.27,25.53 35.27,41.12 35.72,41.57 35.72,42.72 33.9,44.55 29.03,44.55 28.69,44.88 27.92,44.88 27.41,44.37 18.59,44.37 v18.43,44.53
A7/D7  (via drill 0.2 pad 0.41)
  Top 0.089: U1.J1 35.37,23.77 v35.21,23.92 | v15.78,44.35 15.29,44.35 15.28,44.37 14.96,44.05 U3.36
  Bottom 0.089: v35.21,23.92 34.66,24.48 34.66,25.68 34.91,25.93 34.91,43.28 33.82,44.37 28.96,44.37 28.62,44.7 27.99,44.7 27.48,44.19 15.96,44.19 15.78,44.37 v15.78,44.35
A8/D8  (via drill 0.2 pad 0.41)
  Top 0.089: U1.L2 34.11,22.74 34.11,23.24 33.92,23.44 v33.92,23.92 | U3.37 12.42,39.35 13.37,40.3 v13.37,44.17
  Bottom 0.089: v33.92,23.92 34.48,24.48 34.48,25.75 34.73,26.01 34.73,43.21 33.75,44.19 28.88,44.19 28.55,44.53 28.07,44.53 27.55,44.01 13.53,44.01 v13.37,44.17
BUTTON1  (via drill 0.2 pad 0.41)
  Top 0.089: 39.43,18.49 U1.A10 40.01,18.49 v41.06,17.44 | v39.02,45 38.52,45.51 37.37,45.51 37.12,45.76 37.12,48.69 36.87,48.94 35.98,48.94 35.64,48.6 R49.1 34.53,48.05 34.05,48.05 | 33.81,48.05 34.05,48.05 | 33.79,48.08 33.81,48.05 | 33.81,48.06 33.81,48.05 | K1.2 34.05,48.05
  Bottom 0.089: v41.06,17.44 40.2,18.3 40.2,37.49 42.08,39.37 42.08,44.83 41.7,45.21 39.23,45.21 v39.02,45
BUTTON2  (via drill 0.2 pad 0.41)
  Top 0.089: U1.A9 40.78,18.99 v40.93,18.84 | R3.1 48.3,49.18 47.34,48.22 | K2.2 46.88,48.22 47.34,48.22 | 47.34,48.22 47.32,48.2 47.32,45.43 v46.52,44.62
  Bottom 0.089: v40.93,18.84 40.55,19.22 40.55,37.09 42.64,39.17 42.64,40.74 v46.52,44.62
BUTTON3  (via drill 0.2 pad 0.41)
  Top 0.089: U1.B9 38.92,18.99 39.16,19.23 41.04,19.23 v41.44,18.84 | R4.1 v58.96,46.28 59.22,46.28 59.68,46.73 K3.2
  Bottom 0.089: v41.44,18.84 40.73,19.55 40.73,36.95 44.68,40.89 53.58,40.89 v58.96,46.28
BUZZER_CTR  (via drill 0.2 pad 0.41)
  Top 0.089: U1.P9 | U1.P9 32.85,18.99 | U1.P9 33.25,18.61 33.25,17.01 v33.3,16.96 | R5.1 16.75,13.59 v17.18,14.01
  Route15 0.089: v33.3,16.96 32.55,16.21 32.55,14.65 32.29,14.4 30.13,14.4 28.99,13.25 19.97,13.25 18.7,14.52 18.07,14.52 17.56,14.01 v17.18,14.01
DAC0  (via drill 0.2 pad 0.41)
  Top 0.089: U1.E1 37.37,24.55 v38.26,25.44 | 45.5,38.34 U3.11 45.44,39.99 v45.5,40.05
  Route15 0.089: v45.5,40.05 45.5,40.81 44.64,41.68 37.58,41.68 v37.51,41.74
  Bottom 0.089: v38.26,25.44 36.87,26.84 36.87,39.66 37.35,40.14 37.35,41.59 v37.51,41.74
DAC1  (via drill 0.2 pad 0.41)
  Top 0.089: U1.L1 34.37,23.27 34.27,23.36 34.27,24.1 v33.94,24.43 | v28.41,44.19 27.65,44.19 27.66,44.18 U3.26
  Bottom 0.089: v33.94,24.43 34.3,24.78 34.3,25.83 34.55,26.08 34.55,43.13 33.68,44.01 28.59,44.01 v28.41,44.19
DN
  Top 0.142: USB1.A7 34.27,7.16 | 34.27,7.16 34.27,7.86 34.59,8.18 R55.1 D3.1 | USB1.B7 33.27,6.99 33.44,7.16 34.27,7.16
DP
  Top 0.142: D4.1 R56.2 35.48,8.48 34.77,7.77 USB1.B6 34.77,5.31 34.58,5.12 33.94,5.12 33.77,5.3 USB1.A6
FPC_D3/PWM3  (via drill 0.2 pad 0.41)
  Top 0.089: J6.4 6.95,40.51 v7.02,40.43 | U1.A12 40.12,17.49 40.74,16.87 41.37,16.87 41.69,16.55 41.69,16.05 41.44,15.79 v40.17,15.79
  Bottom 0.089: v7.02,40.43 7.02,40.46 6.51,40.98 6.51,42.17 7.82,43.48 32.13,43.48 32.88,42.73 32.88,28.09 32.12,27.33 32.12,22.35 33.94,20.52 33.94,19.73 35.21,18.46 35.21,15.79 35.72,15.28 35.72,14.4 36.1,14.01 38.39,14.01 v40.17,15.79
FPC_D4/PWM4  (via drill 0.2 pad 0.41)
  Top 0.089: U1.G15 36.37,15.15 v36.48,15.03 | J6.5 6.94,40.01 v7.02,39.92
  Bottom 0.089: v7.02,39.92 6.33,40.61 6.33,42.24 7.74,43.66 32.2,43.66 33.06,42.8 33.06,28.02 32.29,27.26 32.29,22.42 34.12,20.59 34.12,19.93 35.53,18.52 35.53,15.98 v36.48,15.03
FPC_D5/PWM5  (via drill 0.2 pad 0.41)
  Top 0.089: J6.6 5.02,39.51 v4.86,39.67 | v41.56,17.44 41.23,17.11 40.89,17.11 39.76,18.23 39.11,18.23 U1.B11
  Bottom 0.089: v41.56,17.44 40.38,18.63 40.38,37.41 42.28,39.32 42.28,44.89 41.78,45.39 36.68,45.39 35.24,46.83 19.29,46.83 19.03,46.58 15.91,46.58 15.62,46.29 7.81,46.29 4.48,42.96 4.48,40.05 v4.86,39.67
FPC_D6/PWM6  (via drill 0.2 pad 0.41)
  Top 0.089: U1.R13 31.33,16.99 v30.77,16.43 | v7.27,39.03 7.25,39.01 J6.7
  Bottom 0.089: v7.27,39.03 7.66,39.41 7.66,42.21 8.67,43.22 18.88,43.22 20.79,41.32 21.32,41.32 22.34,42.34 26.83,42.34 27.21,42.72 28.99,42.72 29.56,42.15 29.56,41.51 31.28,39.8 31.28,31.03 30.52,30.27 30.52,16.68 v30.77,16.43
FPC_D7/A7  (via drill 0.2 pad 0.41)
  Top 0.089: U1.C2 38.11,22.75 38.11,23.11 38.11,23.12 38.11,23.77 v38.26,23.92 | J6.8 5.96,38.53 v4.99,38.53
  Bottom 0.089: v38.26,23.92 37.75,24.43 37.75,24.68 36.33,26.1 36.33,39.88 36.81,40.36 36.81,42.63 33.75,45.69 20.06,45.69 19.93,45.56 19.59,45.22 18.01,45.22 17.84,45.04 7.57,45.04 5.62,43.09 5.62,39.15 v4.99,38.53
FPC_D8/A8  (via drill 0.2 pad 0.41)
  Top 0.089: U1.D1 37.87,24.03 v38.26,24.43 | J6.9 5.97,38.02 v4.99,38.02
  Bottom 0.089: v38.26,24.43 36.51,26.18 36.51,39.81 36.99,40.29 36.99,42.71 33.83,45.87 19.99,45.87 19.51,45.4 17.94,45.4 17.76,45.22 7.5,45.22 5.44,43.16 5.44,39.48 4.65,38.7 4.65,38.35 v4.99,38.02
FPC_D9/A9  (via drill 0.2 pad 0.41)
  Top 0.089: 37.37,22.52 U1.E2 37.61,22.73 37.61,23.11 37.6,23.13 37.6,24.28 v38.26,24.94 | J6.10 5.96,37.52 v4.99,37.52
  Bottom 0.089: v38.26,24.94 36.69,26.51 36.69,39.73 37.17,40.21 37.17,42.78 33.9,46.05 19.92,46.05 19.44,45.57 17.87,45.57 17.69,45.4 7.42,45.4 5.24,43.22 5.24,39.54 4.47,38.77 4.47,38.06 4.99,37.54 v4.99,37.52
FPC_D10/PWM10  (via drill 0.2 pad 0.41)
  Top 0.089: U1.N1 33.37,24.87 v33.94,25.44 | v7.02,37 6.26,37 6.25,37.01 J6.11
  Bottom 0.089: v33.94,25.44 34.12,25.62 34.12,25.9 34.38,26.16 34.38,43.06 33.6,43.83 7.67,43.83 6.15,42.31 6.15,37.87 v7.02,37
FPC_D11/A11  (via drill 0.2 pad 0.41)
  Top 0.089: U1.B4 38.87,21.5 38.89,21.5 39.13,21.74 39.89,21.74 40.37,22.22 40.37,26.64 38.26,28.75 38.26,35.22 36.59,36.89 36.59,40.2 36.23,40.56 34.33,40.56 33.94,40.94 31.62,40.94 31.24,41.32 31.24,44.91 v31.21,44.94 | v7.02,36.49 v7.01,36.51 J6.12
  Bottom 0.089: v31.21,44.94 30.99,45.16 27.95,45.16 27.47,44.69 19.9,44.69 19.72,44.86 18.16,44.86 17.98,44.69 7.72,44.69 5.97,42.94 5.97,37.54 v7.02,36.49
FPC_D12/A12  (via drill 0.2 pad 0.41)
  Top 0.089: U1.G2 | U1.G2 | U1.G2 36.34,22.49 | 36.1,22.75 36.11,22.74 | 36.11,22.74 U1.G2 | v36.48,24.43 36.11,24.06 36.11,22.74 | v7.02,35.99 5.8,35.99 5.82,36.01 J6.13
  Bottom 0.089: v36.48,24.43 35.96,24.96 35.96,40.01 36.28,40.34 36.28,42.66 33.61,45.34 27.87,45.34 27.4,44.86 19.97,44.86 19.8,45.04 18.09,45.04 17.91,44.86 7.64,44.86 5.95,43.17 5.79,43.01 5.79,37.21 v7.02,35.99
FPC_D13/A13  (via drill 0.2 pad 0.41)
  Top 0.089: U1.H1 35.87,24.32 v36.48,24.94 | v41.56,26.71 42.07,26.21 43.37,26.21 43.89,26.72 45,26.72 45.25,26.97 45.25,28.24 46.39,29.38 46.39,30.65 46.77,31.03 50.2,31.03 51.22,30.02 55.03,30.02 55.45,30.44 R79.2
  Route15 0.089: v36.48,24.94 37.88,26.33 41.18,26.33 v41.56,26.71
GND  (via drill 0.2 pad 0.41)
  Top 0.152: v44.61,8.93 44.6,8.92 R25.1
  Top 0.203: U5.12 43.71,27.97 v43.72,27.98 | D8.1 50.67,11.94 50.8,11.94 51.24,12.39 v51.37,12.39
  Top 0.254: U1.D2 37.87,21.63 | 37.87,21.63 37.87,21.49 U1.F6 | U1.H6 U1.J6 35.37,20.85 35.21,21 34.71,21 34.45,20.75 34.45,18.33 34.64,18.15 35.72,18.15 | 35.72,18.15 36.01,18.15 | U1.J10 35.38,18.49 35.72,18.15 | U1.G10 36.35,18.49 36.01,18.15 | U1.F9 37.65,18.99 v37.75,19.09 37.75,21.52 37.87,21.63 | 36.01,18.15 37.06,18.15 v37.5,18.59 | R25.1 44.13,8.92 C33.2 | C51.2 41.1,11.53 C52.2 42.53,11.51 U2.4 | C41.2 36.68,11.53 C40.2 35.81,11.53 C62.2 34.06,11.53 C39.2 34.06,10.64 33.7,10.28 | X4.4 39.09,10.25 38.48,9.64 37.96,9.64 | U5.10 42.71,26.97 v42.45,26.71 | v42.2,30.65 U5.5 42.21,29.76 42.96,29 42.96,28.87 | C14.1 44.5,32.75 C29.1 C30.1 C31.1 44.53,34.57 C11.1 43.36,35.22 42.58,35.22 41.95,34.59 v41.69,34.59 41.69,34.97 41.31,34.97 41.06,35.22 41.06,36.05 U11.4 | R98.1 R97.1 | C49.1 C50.1 | v33.56,27.48 33.97,27.89 C49.1 | U5.7 42.57,28.73 v42.83,29.33 | C49.1 33.97,29.74 | R16.2 44.52,26.08 v43.98,26.08 | Q13.2 48.61,24.87 47.91,25.57 47.91,26.97 | D15.5 D15.10 49.68,18.27 49.24,18.27 49.18,18.33 v49.13,18.33 | R7.1 15.72,13.76 v16.04,14.08
  Top 0.305: J6.18 4.93,33.51 v4.86,33.57 | C12.2 C13.2 C43.2 C42.2 | C32.2 29.07,15.36 29.37,15.67 v30.01,15.67 | U12.6 24,21.09 v24.04,21.13 24.67,21.76 v24.8,21.76 24.82,21.74 U12.4 25.92,21.74 | 25.92,21.74 26.07,21.89 v26.07,22.27 | 25.92,21.74 27.74,21.74 28.05,21.43 C67.1 C66.1 28.94,21.46 v29.25,21.76 | v19.47,21.14 19.47,20.13 19.97,19.62 20.39,19.62 C65.1 | C64.1 21.38,19.7 | D1.1 51.04,15.05 v51.04,15.44 | C15.2 51.39,13.48 | 51.39,13.48 v51.34,13.43 | 51.39,13.48 51.39,12.94 C16.2 51.4,12.42 v51.37,12.39
  Top 0.381: R1.1 D3.2 33.7,10.28 | R1.1 32.83,9.65 32.83,10.26 | R1.1 32.25,9.64 32.24,9.65 | D2.2 30.08,7.66 | D2.2 30.69,8.25 | D2.2 30.7,7.54 30.24,7.08 30.54,7.08 30.77,6.85 | R2.1 37.96,9.64 | R2.1 37.22,9.67 37.22,10.23 | R2.1 D4.2 | USB1.A1_B12 30.77,6.1 | 30.25,5.57 USB1.S3 | USB1.S3 29.72,7.04 29.6,7.16 | USB1.S3 28.68,5.57 28.66,5.56 | USB1.S3 29.72,4.07 29.7,4.06 | USB1.S4 38.32,6.72 37.88,7.16 | USB1.S4 39.26,5.57 39.28,5.56 | USB1.S4 38.32,4.14 38.21,4.03 | 37.78,5.61 37.82,5.57
  Top 0.406: C60.2 28.79,25.93 v29.32,25.93 29.22,25.93 | 37.88,7.16 37.75,7.03 | R54.2 39.34,28.33 v39.3,28.29 | R72.1 20.44,16.28 v20.1,15.94 | v54.39,30.52 54.45,30.59 R95.1 54.5,30.95 R77.1 | R23.2 43.27,4.43 42.71,5 | U10.1 19.94,22.51 19.47,22.03 v19.47,21.14 | C64.1 20.89,19.64 v20.86,19.62 C65.1 20.1,19.62 | J5.4 12.79,5.88 v12.74,5.82 | J1.6 53.81,15.08 v53.88,15.16 | C37.2 43.21,16.86 43.34,16.73 43.34,17.52 C37.2 | C37.2 43.24,17.68 C38.2 44.95,17.68 C36.2 45.02,17.61 45.79,17.61 | D1.1 51.17,14.15 C15.2 | D2.2 30.77,7.59 30.77,6.85 USB1.A1_B12 | U3.30 22.58,42.76 v22.62,42.72
  Top 0.635: 37.75,7.03 37.22,6.49 USB1.B1_A12 37.78,5.61 | 30.77,6.1 30.25,5.57 | USB1.S4 37.82,5.57
  Top 0.686: 6.82,18.09 7.01,18.09 v7.02,18.08 | ANT2.1 6.82,18.09 | 6.82,18.09 6.82,19.14 | 6.82,18.09 6.82,17.32 7.53,17.32
  Top 0.813: 29.72,1.48 29.75,1.44 29.75,1.41 USB1.S1
  Bottom 0.152: MIC1.3 60.41,1.62 60.61,1.82 60.61,2.48 MIC1.4 60,3.09 59.47,3.09 58.84,3.09 58.51,2.76 MIC1.5 58.51,2.38 58.33,2.2 58.33,1.62 MIC1.2
  Bottom 0.254: 58.96,4.74 55.41,8.3 54.26,8.3 | SW1.8 11.28,3.22 17.31,3.22 17.97,3.89 J2.2
  Bottom 0.305: 59.47,3.09 59.47,4.24 58.96,4.74
  Bottom 0.406: 42.71,5 42.71,4.82 J7.5
  other vias: 43.72,36.11 54.14,42.72 62.9,38.14 59.6,44.11 9.94,36.87 1.69,45.38 22.39,26.97 21.75,26.97 22.01,26.46 26.58,28.62 24.93,17.32 24.04,17.44 27.85,11.09 25.82,11.09 24.29,11.09 3.47,29.43 39.28,9.57 38.14,10.1 33.69,10.2 34.33,10.33 43.72,29.33 21.88,25.7 43.95,14.95 3.72,32.68 16.42,17.97 57.44,48.18 60.61,48.81 60.23,45.64 41.15,49.89 28.39,50.1 37.62,49.93 22.01,41.32 17.43,41.32 46.54,14.22 41.69,7.44 2.17,30.67 42.33,34.59 43.72,43.1 49.44,37.13 50.33,36.49 51.09,31.92 40.42,13.38 41.18,13.38 47.41,17.14 39.69,49.9 35.98,49.96 7.02,14.27 12.74,12.36 14.39,12.11 12.1,16.32 12.1,18.35 12.74,19.87 5.88,26.59 6.26,25.7 6.26,24.43 6.89,23.16 6.89,22.14 8.8,25.06 8.8,24.43 8.8,22.14 8.93,20.87 8.93,19.35 7.02,13 7.02,11.73 7.02,10.46 7.02,9.19 7.02,7.92 5.62,7.28 1.81,7.16 1.31,6.65 7.02,15.54 7.02,19.35 7.02,20.62 4.99,26.96 4.99,28.23 4.99,29.5 7.27,24.43 7.27,25.7 8.04,19.86 8.16,18.71 8.16,17.44 8.16,16.17 8.16,14.9 8.16,13.63 8.16,12.36 7.02,16.81 6.26,6.65 1.31,5.76 2.45,5.76 7.66,5.51 3.08,4.81 1.18,4.68 1.69,3.92 8.93,18.08 8.93,16.81 8.93,15.54 8.93,14.27 8.93,13 8.93,11.73 10.2,22.14 10.2,20.62 10.2,19.09 10.2,17.82 10.2,16.43 10.2,15.16 10.2,13.63 10.2,12.36 11.34,21.25 11.34,19.98 11.34,18.71 11.34,17.32 11.34,15.92 11.34,14.65 11.34,13.13 11.34,11.73 1.03,30.67 1.03,32.83 2.3,32.83 2.3,34.73 1.15,34.98 1.41,38.03 1.41,40.95 1.54,43.11 7.27,50.84 16.42,51.73 48.17,8.3 64.17,33.19 62.39,43.1 64.81,39.41 9.05,31.29 21.5,33.72 25.05,35.99 21.68,32.67 28.74,36.24 24.29,6.01 27.72,5.51 62.65,29.25 50.33,10.33 48.8,9.32 55.79,11.73 60.87,13.63 60.87,17.44 60.87,19.35 60.87,21.25 58.33,23.16 55.79,15.54 55.79,21.25 58.33,17.44 55.79,17.44 55.79,19.35 58.33,19.35 55.79,13.63 38.08,9.11 37.5,6.9 19.21,49.32 54.26,49.7 50.45,50.08 48.42,50.08 66.58,48.56 61.38,49.96 17.05,4.11 55.79,23.16 55.79,25.06 58.33,25.06 60.87,25.06 60.87,23.16 58.33,21.25 58.33,15.54 58.33,13.63 60.87,15.54 58.33,11.73 60.87,11.73 63.41,15.54 63.41,17.44 63.41,19.35 63.41,23.16 63.41,25.06 66.58,25.06 66.58,23.16 66.58,21.25 66.58,19.35 66.58,17.44 66.58,15.54 66.58,13.63 66.58,11.73 62.14,7.28 62.14,4.74 65.31,5.38 11.97,35.86 15.15,35.86 11.97,32.68 15.15,32.68 18.96,32.68 18.96,30.02 21.5,36.49 17.69,36.49 10.96,40.3 58.33,40.94 13.24,2.2 17.69,2.2 32.42,3.09 35.6,3.09 28.48,3.47 20.48,2.2 25.94,1.19 43.09,2.2 48.8,2.2 50.71,2.2 52.61,2.2 55.15,2.2 60.23,7.28 64.04,8.55 47.23,27.96 47.2,27.27 38.72,29.38 45.83,17.47 45.83,18.1 51.65,18.33 30.64,3.22 37.25,3.09 33.94,3.09 24.04,42.72 23.15,51.1 17.75,42.53 16.8,50.84 19.85,49.7 13.43,50.02 9.37,50.78 9.37,48.24 28.99,35.22 24.42,32.3
  pour Top (isolate 0.203, rank 6, no thermals): 29.12,50.59 61.5,50.59 61.5,48.56 29.12,48.56
  pour Top: -1.36,30.78 9.43,30.78 9.43,3.73 -1.36,3.73
  pour Bottom: -1.36,30.78 9.43,30.78 9.43,6.01 -1.36,6.01
  pour Top (isolate 0.254, no thermals): 23.66,11.47 27.47,11.47 27.47,11.03 26.64,10.2 23.78,10.2 23.4,10.59 23.4,11.22
  pour Top (isolate 0.254, no thermals): 23.28,26.08 22.13,26.08 21.63,26.59 21.63,27.32 21.91,27.6 23.5,27.6 23.78,27.32 23.78,26.59
  pour Top (isolate 0.254, rank 2, no thermals): -1.36,3.73 6.39,3.73 6.39,5.76 6.13,6.01 -1.36,6.01
  pour Top (isolate 0.203, rank 6): -0.36,55.03 69.64,55.03 69.64,-0.97 3.64,-0.97 3.64,-1.59 -0.36,-1.59
  pour Route2 (isolate 0.203, rank 6): -0.36,55.03 69.64,55.03 69.64,-0.97 3.64,-0.97 3.64,-2.21 -0.36,-2.21
  pour Bottom (isolate 0.203, rank 6, no thermals): -0.36,55.03 69.64,55.03 69.64,-0.97 3.64,-0.97 3.64,-3.45 -0.36,-3.45
GPCLK0  (via drill 0.2 pad 0.41)
  Top 0.089: 32.38,20.99 U1.R5 31.9,20.99 v31.4,20.49 | U3.7 v50.52,40.14 v50.51,40.15
  Route15 0.089: 50.51,39.62 v50.51,40.15 50.51,41.52 50.07,41.95 50,42.03 49.69,42.34 33.56,42.34 33.06,41.83 v32.04,41.83
  Bottom 0.089: v31.4,20.49 31.23,20.67 31.23,29.43 31.99,30.19 31.99,40.48 31.58,40.9 31.58,41.36 v32.04,41.83
GPCLK1  (via drill 0.2 pad 0.41)
  Top 0.089: U1.R4 32.06,21.49 31.41,22.14 31.41,26.84 31.4,26.84 29.93,28.31 v28.36,28.31 | U3.29 22.58,36.94 22.9,36.62 v27.21,36.62
  Bottom 0.089: v28.36,28.31 28.36,29.89 27.47,30.78 27.47,36.37 v27.21,36.62
GPCLK2  (via drill 0.2 pad 0.41)
  Top 0.089: 32.86,20.49 U1.P6 33.06,20.49 v33.23,20.31 | v20.97,41.8 20.04,40.87 U3.31
  Bottom 0.089: v20.97,41.8 22.29,43.12 31.98,43.12 32.52,42.58 32.52,28.24 31.76,27.48 31.76,22.2 33.23,20.73 v33.23,20.31
GYROSCOPE_INT1  (via drill 0.2 pad 0.41)
  Top 0.089: U1.K14 34.84,16.49 34.61,16.26 | 34.6,16.25 34.61,16.26 | v35.21,14.01 34.6,14.62 34.6,15.85 34.61,15.86 34.61,16.26 | 42.96,26.59 v42.95,26.6 42.95,26.62 43.21,26.87 U5.11
  Route15 0.089: v43.98,16.17 41.56,16.17 v40.42,15.03
  Bottom 0.089: v43.98,16.17 43.57,16.58 43.57,18.28 42.96,18.89 42.96,21.63 42.2,22.4 42.2,25.83 42.96,26.59 v42.95,26.6 | v40.42,15.03 39.15,13.76 35.47,13.76 v35.21,14.01
I2C0_SCL  (via drill 0.2 pad 0.41)
  Top 0.089: U1.R12 32.11,17.49 v31.96,17.63 | U5.4 v42.71,30.65 42.71,31.34 R13.2 41.57,32.85 U11.6 | U3.28 25.11,43.7 25.11,42.97 25.29,42.79 v25.94,42.79
  Route15 0.089: v42.71,30.65 42.33,30.27 31.57,30.27 v31.23,29.93
  Bottom 0.089: v31.96,17.63 v31.96,17.65 31.05,18.56 31.05,29.75 v31.23,29.93 31.81,30.51 31.81,40.41 30.94,41.28 30.94,42.29 30.29,42.95 26.05,42.95 25.94,42.84 v25.94,42.79
I2C0_SDA  (via drill 0.2 pad 0.41)
  Top 0.089: U1.P13 32.87,16.97 32.62,16.73 32.5,16.73 32.49,16.73 31.71,16.73 30.64,15.67 v30.59,15.67 | U5.6 41.69,29.4 v41.69,30.65 41.69,31.24 41.96,31.5 41.96,31.67 42.02,31.61 R14.2 41.07,32.48 U11.5 41.07,33.43 | 25.12,39.35 U3.27 25.12,40.49 25.44,40.81 29.63,40.81 v30.13,40.3
  Route15 0.089: v41.69,30.65 30.52,30.65 v29.93,30.07
  Bottom 0.089: v30.59,15.67 30.29,15.96 30.29,29.71 v29.93,30.07 29.93,30.58 30.64,31.29 30.64,39.8 v30.13,40.3
I2C1_SCL  (via drill 0.2 pad 0.41)
  Top 0.089: U1.R15 32.04,15.67 v31.35,15.67 | U3.5 53.1,38.24 v53.1,36.42 | R33.1 v47.28,9.57 | J4.1 55.26,9.04 v55.28,9.06
  Route15 0.089: v31.02,13.76 31.44,13.34 32.23,13.34 34.35,11.22 40.55,11.22 42.2,9.57 v47.28,9.57 47.53,9.57 48.55,8.55 53.63,8.55 54.14,9.06 v55.28,9.06
  Bottom 0.089: v31.35,15.67 31.35,14.09 v31.02,13.76 | v53.1,36.42 52.13,35.45 51.65,35.45 51.22,35.02 51.22,32.94 52.49,31.67 52.49,21.96 50.48,19.96 49.16,19.96 48.24,19.04 48.24,17.14 49.12,16.26 49.12,11.06 47.64,9.57 v47.28,9.57
I2C1_SDA  (via drill 0.2 pad 0.41)
  Top 0.089: U1.P14 32.62,16.24 32.62,15.86 32.62,15.85 31.8,15.03 v31.79,15.03 | U3.3 55.6,37.01 v55.61,37 | R34.1 47.23,8.68 47.66,9.11 47.66,9.95 v47.53,10.08 | J4.2 53.26,9.05 v53.25,9.06
  Route15 0.089: v53.25,9.06 52.99,8.81 48.68,8.81 47.53,9.95 v47.53,10.08 47.28,10.33 41.82,10.33 40.68,11.47 34.35,11.47 32.06,13.76 v31.66,13.76
  Bottom 0.089: v31.79,15.03 31.79,13.89 v31.66,13.76 | v47.53,10.08 48.91,11.45 48.91,16.12 47.99,17.04 47.99,19.12 49.06,20.19 50.38,20.19 52.23,22.04 52.23,31.54 50.96,32.81 50.96,35.07 51.57,35.68 51.88,35.68 53.2,37 v55.61,37
I2S_BLCK  (via drill 0.2 pad 0.41)
  Top 0.089: v44.61,44.12 45.03,44.12 U3.12 | U1.H15 35.87,14.38 v36.99,13.25
  Route15 0.089: v44.61,44.12 v44.61,44.11 43.85,44.88 v41.18,44.88
  Bottom 0.089: v41.18,44.88 41.91,44.15 41.91,39.45 40.02,37.56 40.02,29 | v36.99,13.25 37.12,13.38 39.79,13.38 41.56,15.16 41.56,16.4 40.02,17.94 40.02,29 | 40.02,29
I2S_LRCLK  (via drill 0.2 pad 0.41)
  Top 0.089: v38.14,16.94 38.14,17.06 37.88,17.32 37.5,17.32 37.25,17.06 37.25,16.68 37.31,16.62 37.31,16.54 U1.E14 | U3.35 14.96,39.22 16.29,40.56 16.29,45.24 v17.05,46.01
  Bottom 0.089: v38.14,16.94 38.14,17.44 38.82,18.13 38.82,26.18 37.4,27.6 37.4,39.44 38.39,40.43 38.39,43.13 35.09,46.42 19.75,46.42 19.33,46.01 v17.05,46.01
I2S_SDIN  (via drill 0.2 pad 0.41)
  Top 0.089: U1.D15 37.87,15.68 v37.94,15.6 | v12.42,45.95 12.42,43.71 U3.38
  Bottom 0.089: v37.94,15.6 37.93,15.62 39,16.69 39,26.25 37.58,27.67 37.58,39.36 38.57,40.35 38.57,43.2 35.14,46.63 19.36,46.63 19.1,46.36 16.1,46.36 15.69,45.95 v12.42,45.95
I2S_SDOUT  (via drill 0.2 pad 0.41)
  Top 0.089: v9.81,45.76 9.81,43.77 U3.40 | U1.D14 37.87,16.7 v37.63,16.94
  Bottom 0.089: v37.63,16.94 37.63,17.19 38.64,18.21 38.64,26.08 37.22,27.5 37.22,39.51 38.2,40.49 38.2,43.07 35.04,46.23 19.84,46.23 19.37,45.75 17.79,45.75 17.66,45.62 9.96,45.62 v9.81,45.76
IR_CTL  (via drill 0.2 pad 0.41, 0.25 pad 0.51)
  Top 0.089: 38.88,20.99 U1.B5 38.88,20.99 39.13,21.23 41.08,21.23 43.6,23.75 v43.6,25.06 | v46.7,29 46.9,28.8 R47.2
  Route15 0.089: v46.7,29 45.48,27.78 45.48,26.94 v43.6,25.06 43.6,24.94
IRQ0  (via drill 0.2 pad 0.41)
  Top 0.089: U1.L15 34.37,14.05 33.94,13.63 33.06,13.63 32.35,14.34 30.32,14.34 v29.88,14.78 | v19.59,23.16 19.74,23.31 U10.2 | R103.1 13.96,15.67 16.93,15.67 17.31,16.05 18.99,16.05 v19.23,16.29
  Bottom 0.089: v29.88,14.78 28.36,14.78 26.96,13.38 21.37,13.38 20.1,14.65 20.1,15.41 v19.23,16.29 18.91,16.61 18.91,22.47 v19.59,23.16
LCD_BACKLIGHT_CTR  (via drill 0.2 pad 0.41)
  Top 0.089: U1.N2 33.37,22.21 33.5,22.08 33.51,22.09 v33.6,22.09 | v44.1,24.81 44.23,24.81 44.53,25.11 R17.2
  Route15 0.089: v33.6,22.09 33.87,21.82 39.25,21.82 39.86,22.43 43.72,22.43 43.93,22.64 43.93,24.64 v44.1,24.81
LCD_CS  (via drill 0.2 pad 0.41)
  Top 0.089: U1.E15 37.37,15.61 v37.94,15.03 | R74.2 v46.14,34.59
  Route15 0.089: 38.03,15.03 v37.94,15.03 37.98,15.03 40.74,17.79 43.22,17.79 49.29,23.86 49.29,33.09 47.79,34.59 v46.14,34.59
LCD_D/C  (via drill 0.2 pad 0.41)
  Top 0.089: U1.P1 32.87,23.22 v33,23.36 | R57.2 v46.14,35.48
  Route15 0.089: v46.14,35.48 45.76,35.1 45.76,32.94 46.01,32.68 48.23,32.68 48.75,32.16 48.75,24.08 42.99,18.33 40.52,18.33 38.57,16.38 36.92,16.38 v36.36,16.94
  Bottom 0.089: v33,23.36 33,22.22 33.7,21.52 34.7,21.52 35.85,20.36 35.85,17.44 v36.36,16.94
LCD_MISO  (via drill 0.2 pad 0.41)
  Top 0.089: U1.G14 36.61,16.24 36.61,15.86 36.61,15.54 37.31,14.84 v37.31,14.4 | v46.16,33.14 46.36,33.14 R76.2
  Route15 0.089: v37.31,14.4 37.31,15.86 37.65,16.2 38.64,16.2 40.59,18.15 43.07,18.15 48.93,24.01 48.93,32.42 48.41,32.94 46.37,32.94 v46.16,33.14
LCD_MOSI  (via drill 0.2 pad 0.41)
  Top 0.089: U1.F15 36.87,15.54 37.94,14.46 v37.94,14.4 | R75.2 v46.15,33.7
  Route15 0.089: v37.94,14.4 37.56,14.78 37.56,15.79 37.79,16.02 38.72,16.02 40.67,17.97 43.14,17.97 49.11,23.94 49.11,32.76 48.17,33.7 v46.15,33.7
LCD_RESET  (via drill 0.2 pad 0.41)
  Top 0.089: 32.84,22.49 U1.P2 32.61,22.74 32.61,22.86 32.61,23.11 32.61,23.12 32.61,27.69 v31.96,28.34 | 44.59,35.46 R48.1 v44.53,36.87 44.53,39.97 44.99,40.43 46.26,40.43 v46.89,39.8
  Route15 0.089: v32.04,41.32 32.93,41.32 33.69,42.08 45.76,42.08 45.98,41.85 46.01,41.83 46.9,40.94 v46.89,39.8
  Bottom 0.089: v31.96,28.34 32.34,28.72 32.34,41.01 v32.04,41.32 | U4.2 47.96,35.05 47.85,35.16 47.85,36.49 47.47,36.87 v44.53,36.87
LCD_SCK  (via drill 0.2 pad 0.41)
  Top 0.089: 46.77,36.37 R35.2 v46.14,36.37 | U1.F14 v36.87,17.06
  Route15 0.089: v46.14,36.37 45.56,35.8 45.56,32.87 45.57,32.87 46.01,32.43 47.99,32.43 48.57,31.85 48.57,24.16 42.92,18.5 40.45,18.5 38.5,16.55 37.37,16.55 v36.87,17.06
LCD_XL  (via drill 0.2 pad 0.41)
  Top 0.089: U1.P10 32.85,18.49 32.6,18.74 28.86,18.74 v28.74,18.87 | R39.1 45.86,26.66 v45.86,26.69 45.88,26.69
  Route15 0.089: v28.74,18.87 28.74,18.97 29.68,19.91 29.68,20.41 30.91,21.64 39.32,21.64 39.93,22.25 43.8,22.25 44.11,22.56 44.11,24.34 44.44,24.67 44.44,25.37 45.43,26.36 45.76,26.69 v45.86,26.69
LCD_XR  (via drill 0.2 pad 0.41)
  Top 0.089: v44.99,24.68 44.93,24.68 R41.1 | v28.88,18.37 29,18.49 U1.R10
  Route15 0.089: v28.88,18.37 29.18,18.37 30.03,19.22 30.03,20.26 31.06,21.29 39.47,21.29 40.08,21.89 43.94,21.89 44.47,22.42 44.47,24.16 v44.99,24.68
LCD_YD  (via drill 0.2 pad 0.41)
  Top 0.089: U1.P11 32.84,17.99 32.6,18.23 32.5,18.23 32.49,18.23 29.6,18.23 v29.32,17.95 29.45,18.08 | v44.99,23.79 44.61,23.41 R42.1
  Route15 0.089: v29.32,17.95 30.21,18.84 30.21,20.18 31.13,21.11 39.55,21.11 40.16,21.72 44.02,21.72 44.64,22.34 44.64,23.44 v44.99,23.79
LCD_YU  (via drill 0.2 pad 0.41)
  Top 0.089: v29.33,19.09 29.44,18.99 U1.R9 | R40.1 46.32,25.19 v45.88,24.75
  Route15 0.089: v29.33,19.09 29.86,19.61 29.86,20.33 30.99,21.46 39.4,21.46 40.01,22.07 43.87,22.07 44.29,22.49 44.29,24.27 44.62,24.6 44.62,24.94 44.83,25.15 45.47,25.15 v45.88,24.75
LCDVCC_3V3  (via drill 0.2 pad 0.41)
  Top 0.406: C31.2 C30.2 | C30.2 45.47,32.8 | C29.2 45.47,32.8 | 45.47,32.8 R48.2 | C30.2 45.47,32.22 FB2.2 46.14,31.55 v46.64,31.55
  Bottom 0.089: U4.10 49.4,28.65
  Bottom 0.406: U4.10 49.85,28.65
  Bottom 0.508: U4.10 47.76,28.65 47.66,28.75 47.66,28.87 | U4.9 47.92,29.45 | 47.92,29.45 47.73,29.45 47.66,29.38 | 47.66,29.38 47.66,29.76 | 47.66,29.76 47.66,30.52 v46.64,31.54 v46.64,31.55 | 47.66,29.76 47.91,29.51 | 47.66,29.38 47.66,28.87 | 47.66,28.87 47.85,28.68 | 47.92,29.45 47.72,29.25
MCU_FLASH_QSPI_CLK
  Top 0.089: U1.R3 32.24,21.99 31.76,22.46 31.76,27.12 27.98,30.91 27.98,32.43 26.58,33.83 U14.6
MCU_FLASH_QSPI_CS  (via drill 0.2 pad 0.41)
  Top 0.089: U1.P5 32.62,21.23 32.5,21.23 32.49,21.23 32.06,21.23 31.23,22.07 31.23,26.33 v29.96,27.6 | R32.1 34.33,30.91 33.94,31.29 U14.1 29.88,31.29 v29.86,31.27
  Bottom 0.089: v29.96,27.6 29.96,29.31 29.5,29.76 29.5,30.91 v29.86,31.27
MCU_FLASH_QSPI_IO0
  Top 0.089: 32.34,22.99 U1.R1 32.37,27.33 30.39,29.31 30.39,30.14 28.23,32.3 28.23,33.7 28.17,33.76 26.83,35.1 U14.5
MCU_FLASH_QSPI_IO1  (via drill 0.2 pad 0.41)
  Top 0.089: 32.87,22 U1.P3 32.61,22.24 32.24,22.24 31.94,22.54 31.94,27.19 28.61,30.52 v28.61,31.03 | U14.2 31.66,32.56 31.28,32.94 29.12,32.94 v28.61,32.43
  Bottom 0.089: v28.61,31.03 v28.61,32.43
MCU_FLASH_QSPI_IO2  (via drill 0.2 pad 0.41)
  Top 0.089: 32.33,22.49 U1.R2 32.12,22.73 32.12,27.27 29.12,30.27 v29.12,30.78 29.12,30.91 | v29.75,33.83 U14.3 34.72,33.83 R58.1
  Bottom 0.089: v29.12,30.78 29.12,33.19 v29.75,33.83
MCU_FLASH_QSPI_IO3
  Top 0.089: U1.P4 32.62,21.74 32.12,21.74 31.58,22.27 31.58,26.98 29.19,29.37 R59.1 28.42,30.14 27.72,30.84 27.72,32.18 27.34,32.56 U14.7
MCU_RESET  (via drill 0.2 pad 0.41)
  Top 0.089: 39.46,19.49 U1.A8 39.5,19.49 39.56,19.42 41.39,19.42 41.82,18.99 41.82,18.21 v42.58,17.44 v42.57,17.43 | R30.2 47.36,14.77 v46.95,15.18 | v61.02,36.93 61.78,36.93 63.36,35.35 63.36,32.81 62.66,32.11 SW3.1 61.61,32.2 61.55,32.2 60.97,31.62 60.97,28.84 D6.2 | J3.4 12.42,49.39 v12.48,49.32
  Route15 0.089: v42.58,17.44 44.69,17.44 v46.95,15.18 | v41.95,37.38 40.68,37.38 38.39,39.67 14.26,39.67 13.75,40.18 13.75,45.38 12.48,46.65 v12.48,49.32
  Bottom 0.089: J7.4 43.98,4.11 43.98,10.99 42.86,12.11 42.86,17.16 v42.58,17.44 41.82,18.21 41.82,19.3 40.96,20.16 40.96,36.91 41.44,37.38 v41.95,37.38 41.95,37.76 43.34,39.16 43.98,39.16 59.8,39.16 61.02,37.94 v61.02,36.93
MIC_OUTPUT  (via drill 0.2 pad 0.41)
  Top 0.089: U1.A4 39.89,21.49 40.29,21.89 41.26,21.89 v42.66,23.29 | v43.98,16.71 44.5,16.71 C55.2
  Bottom 0.089: v43.98,16.71 43.85,16.83 43.85,18.26 43.16,18.94 43.16,21.81 42.71,22.27 42.71,23.23 v42.66,23.29
N$1
  Top 0.152: U1.A6 40.16,20.49 39.79,20.49
  Top 0.406: 39.79,20.49 42.25,20.49 43.25,21.49 43.61,21.4 L6.1
N$2
  Top 0.089: R12.2 36.39,26.97 36.87,26.49 36.87,23.67 36.61,23.41 36.61,23.12 36.61,23.11 36.61,22.73 | U1.F2 36.85,22.49 36.61,22.73 | 36.61,22.73
N$3  (via drill 0.2 pad 0.41)
  other vias: 31.94,8.25 31.4,8.25 31.4,8.71 31.94,8.71 29.19,9.01 29.19,8.55 28.69,8.55 28.69,9.01
  pour Top (isolate 0.203, no thermals): 31.91,5.63 31.35,5.63 31.35,5.66 31.38,5.68 31.38,7.82 31.15,8.05 31.15,8.81 31.3,8.96 32.04,8.96 32.14,8.86 32.14,8.1 31.88,7.83
  pour Top (no thermals): 27.64,10.46 29.47,10.46 29.58,10.36 29.58,8.53 29.4,8.35 27.82,8.35 27.64,8.53
  pour Bottom (no thermals): 28.48,9.32 31.91,9.32 32.17,9.06 32.17,8.05 28.48,8.05
  pour Top (no thermals): 31.4,6.65 31.4,4.74 32.55,3.6 35.6,3.6 36.74,4.74 36.74,5.63 36.61,5.76 36.36,5.76 35.34,4.74 32.67,4.74 31.91,5.51 31.91,6.65
N$4
  Top 0.145: USB1.A5 32.77,8.67 R1.2
N$5
  Top 0.142: 35.77,7.22 R2.2
  Top 0.145: USB1.B5 35.77,7.22
N$6
  Top 0.254: Q4.3 17.62,12.95 R6.2
N$7  (via drill 0.2 pad 0.41)
  Top 0.254: R6.1 19.34,13.51 19.4,13.44 19.4,12.49 19.47,12.42 | D5.+ 19.47,12.42 | v19.4,12.05 19.4,12.35 19.47,12.42
  Route15 0.254: v54.26,7.66 43.6,7.66 40.42,10.84 34.3,10.84 32.65,12.49 19.85,12.49 v19.4,12.05
  Bottom 0.254: BUZ1.- 56.12,5.81 v54.26,7.66
N$8
  Top 0.089: Q4.1 16.74,10.78 15.72,11.79 R7.2 R5.2
N$9  (via drill 0.25 pad 0.51)
  Top 0.152: v10.83,0.55 v11.4,0.55 v11.4,1.44 v10.83,1.44
N$10  (via drill 0.2 pad 0.41)
  Top 0.089: C12.1 R35.1 v47.22,35.99
  Bottom 0.089: U4.3 47.93,34.25 47.66,34.52 47.66,35.54 v47.22,35.99
N$11
  Top 0.145: ANT2.2 7.99,21.54 C28.2 L3.1 8.02,22.42
N$12  (via drill 0.2 pad 0.41)
  Top 0.089: U1.K15 34.87,14.87 v35.21,14.52 | R69.1 7.14,27.61 6.64,28.11 v6.64,29
  Route15 0.089: v31.96,29.53 30.77,28.34 28.97,28.34 28.57,27.94 21.74,27.94 20.66,26.86 10.96,26.86 8.69,29.13 6.77,29.13 v6.64,29
  Bottom 0.089: v35.21,14.52 34.71,15.03 34.71,18.33 33.74,19.3 33.28,19.3 32.72,19.86 | 32.72,19.86 32.72,20.74 31.4,22.05 31.4,28.98 v31.96,29.53 | 32.72,19.86 32.72,19.84
N$13  (via drill 0.2 pad 0.41)
  Top 0.089: 35.38,16.49 U1.J14 35.35,16.49 35.11,16.25 35.11,15.13 v35.21,15.03 | v8.54,28.11 7.63,28.11 R68.1
  Route15 0.089: v31.89,28.92 31.13,28.16 29.04,28.16 28.64,27.76 21.81,27.76 20.73,26.68 10.23,26.68 8.8,28.11 v8.54,28.11
  Bottom 0.089: v31.89,28.92 31.58,28.62 31.58,22.12 32.9,20.81 32.9,20.02 33.44,19.48 33.94,19.48 34.96,18.46 34.96,15.28 v35.21,15.03
N$14
  Top 0.406: Q7.1 63.54,47.67 62.39,46.53 Q8.3 61.52,44.26 R91.1 59.89,43.31 59.89,35.44 61.22,34.11 SW3.2
N$15  (via drill 0.2 pad 0.41)
  Top 0.089: v47.22,35.1 R57.1 C13.1
  Bottom 0.089: U4.4 47.91,33.45 47.66,33.7 47.66,34.27 47.22,34.72 v47.22,35.1
N$16
  Top 0.089: R65.2 8.13,29.71 U10.23
N$17  (via drill 0.2 pad 0.41)
  Top 0.089: v47.22,34.21 R74.1
  Bottom 0.089: U4.5 47.95,32.65 47.66,32.94 47.66,33.38 47.22,33.83 v47.22,34.21
N$18  (via drill 0.2 pad 0.41)
  Top 0.089: v47.22,33.32 R75.1 C43.1
  Bottom 0.089: U4.6 47.98,31.85 47.22,32.62 v47.22,33.32
N$19
  Top 0.089: U10.22 8.2,30.51 R10.2
N$20
  Top 0.152: Q13.3 50.96,24.55 R83.2
N$21
  Top 0.089: R47.1 R80.1 50.43,27.84 49.77,27.17 49.45,27.17 Q13.1
N$22  (via drill 0.2 pad 0.41)
  Top 0.089: C42.1 R76.1 47.6,31.95 v47.44,31.79
  Bottom 0.089: U4.7 47.9,31.05 47.44,31.5 v47.44,31.79
N$23